# Altium project helix_4.PrjPcb
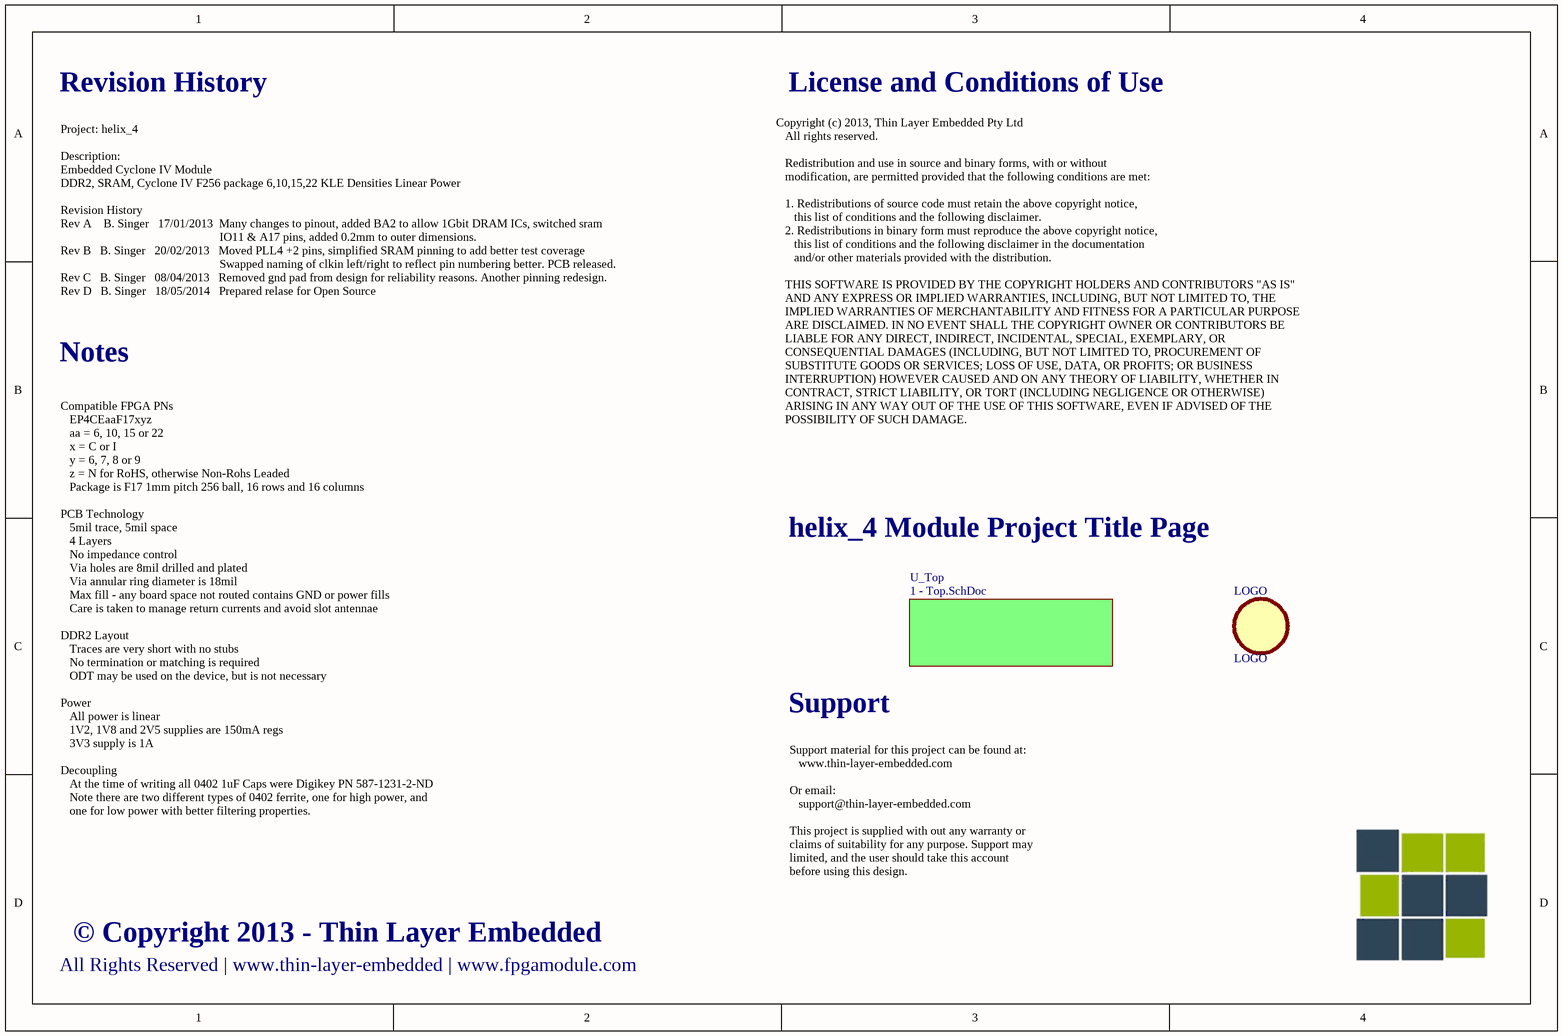
[diagram p0: 0 - Title.SchDoc]
6 sheets, 83 parts. Net scope: flat (ports and power ports of the same name join across sheets).
Board file: helix_4.PcbDoc
Sheets:
  0 - Title.SchDoc
    U_Top = 1 - Top.SchDoc
      U_FPGA = 2 - FPGA.SchDoc
      U_DDR2 DRAM = 4 - DDR2 DRAM.SchDoc
      U_SRAM = 3 - SRAM.SchDoc
      U_Power = 5 - Power.SchDoc

## Sheet 0 - Title.SchDoc
size A4; PageSetup: Record=PageOptions|CenterHorizontal=True|CenterVertical=True|PrintScale=0.71|XCorrection=1.00|YCorrection=1.00|PrintKind=1|BorderSize=5000000|LeftOffset=0|BottomOffset=0|Orientation=2|PaperLength=1000|PaperWidth=1000|Scale=100|PaperSource=258|PrintQuality=600|MediaType=1|DitherType=10|PaperKind=A4|PrintScaleMode=1

### Parts
LOGO  LOGO  [LOGO_VLARGE_SILK]

### Sub-sheets
U_Top = 1 - Top.SchDoc: no entries

### Nets

Not connected (* = marked no-connect by the designer): LOGO 1(FID)

### Notes on the sheet
- Revision History
- License and Conditions of Use
- Project: helix_4
  Description:
  Embedded Cyclone IV Module
  DDR2, SRAM, Cyclone IV F256 package 6,10,15,22 KLE Densities Linear Power
  Revision History
  Rev A    B. Singer   17/01/2013  Many changes to pinout, added BA2 to allow 1Gbit DRAM ICs, switched sram
  IO11 & A17 pins, added 0.2mm to outer dimensions.
  Rev B   B. Singer   20/02/2013   Moved PLL4 +2 pins, simplified SRAM pinning to add better test coverage
  Swapped naming of clkin left/right to reflect pin numbering better. PCB released.
  Rev C   B. Singer   08/04/2013   Removed gnd pad from design for reliability reasons. Another pinning redesign.
  Rev D   B. Singer   18/05/2014   Prepared relase for Open Source
- Notes
- Copyright (c) 2013, Thin Layer Embedded Pty Ltd
  All rights reserved.
  Redistribution and use in source and binary forms, with or without
  modification, are permitted provided that the following conditions are met:
  1. Redistributions of source code must retain the above copyright notice,
  this list of conditions and the following disclaimer.
  2. Redistributions in binary form must reproduce the above copyright notice,
  this list of conditions and the following disclaimer in the documentation
  and/or other materials provided with the distribution.
  THIS SOFTWARE IS PROVIDED BY THE COPYRIGHT HOLDERS AND CONTRIBUTORS "AS IS"
  AND ANY EXPRESS OR IMPLIED WARRANTIES, INCLUDING, BUT NOT LIMITED TO, THE
  IMPLIED WARRANTIES OF MERCHANTABILITY AND FITNESS FOR A PARTICULAR PURPOSE
  ARE DISCLAIMED. IN NO EVENT SHALL THE COPYRIGHT OWNER OR CONTRIBUTORS BE
  LIABLE FOR ANY DIRECT, INDIRECT, INCIDENTAL, SPECIAL, EXEMPLARY, OR
  CONSEQUENTIAL DAMAGES (INCLUDING, BUT NOT LIMITED TO, PROCUREMENT OF
  SUBSTITUTE GOODS OR SERVICES; LOSS OF USE, DATA, OR PROFITS; OR BUSINESS
  INTERRUPTION) HOWEVER CAUSED AND ON ANY THEORY OF LIABILITY, WHETHER IN
  CONTRACT, STRICT LIABILITY, OR TORT (INCLUDING NEGLIGENCE OR OTHERWISE)
  ARISING IN ANY WAY OUT OF THE USE OF THIS SOFTWARE, EVEN IF ADVISED OF THE
  POSSIBILITY OF SUCH DAMAGE.
- helix_4 Module Project Title Page
- Support
- Compatible FPGA PNs
  EP4CEaaF17xyz
  aa = 6, 10, 15 or 22
  x = C or I
  y = 6, 7, 8 or 9
  z = N for RoHS, otherwise Non-Rohs Leaded
  Package is F17 1mm pitch 256 ball, 16 rows and 16 columns
  PCB Technology
  5mil trace, 5mil space
  4 Layers
  No impedance control
  Via holes are 8mil drilled and plated
  Via annular ring diameter is 18mil
  Max fill - any board space not routed contains GND or power fills
  Care is taken to manage return currents and avoid slot antennae
  DDR2 Layout
  Traces are very short with no stubs
  No termination or matching is required
  ODT may be used on the device, but is not necessary
  Power
  All power is linear
  1V2, 1V8 and 2V5 supplies are 150mA regs
  3V3 supply is 1A
  Decoupling
  At the time of writing all 0402 1uF Caps were Digikey PN 587-1231-2-ND
  Note there are two different types of 0402 ferrite, one for high power, and
  one for low power with better filtering properties.
- All Rights Reserved | www.thin-layer-embedded | www.fpgamodule.com
- © Copyright 2013 - Thin Layer Embedded
- Support material for this project can be found at:
  www.thin-layer-embedded.com
  Or email:
  support@thin-layer-embedded.com
  This project is supplied with out any warranty or
  claims of suitability for any purpose. Support may
  limited, and the user should take this account
  before using this design.

### Library data of the parts
LOGO = FID

## Sheet 1 - Top.SchDoc
size A4 portrait
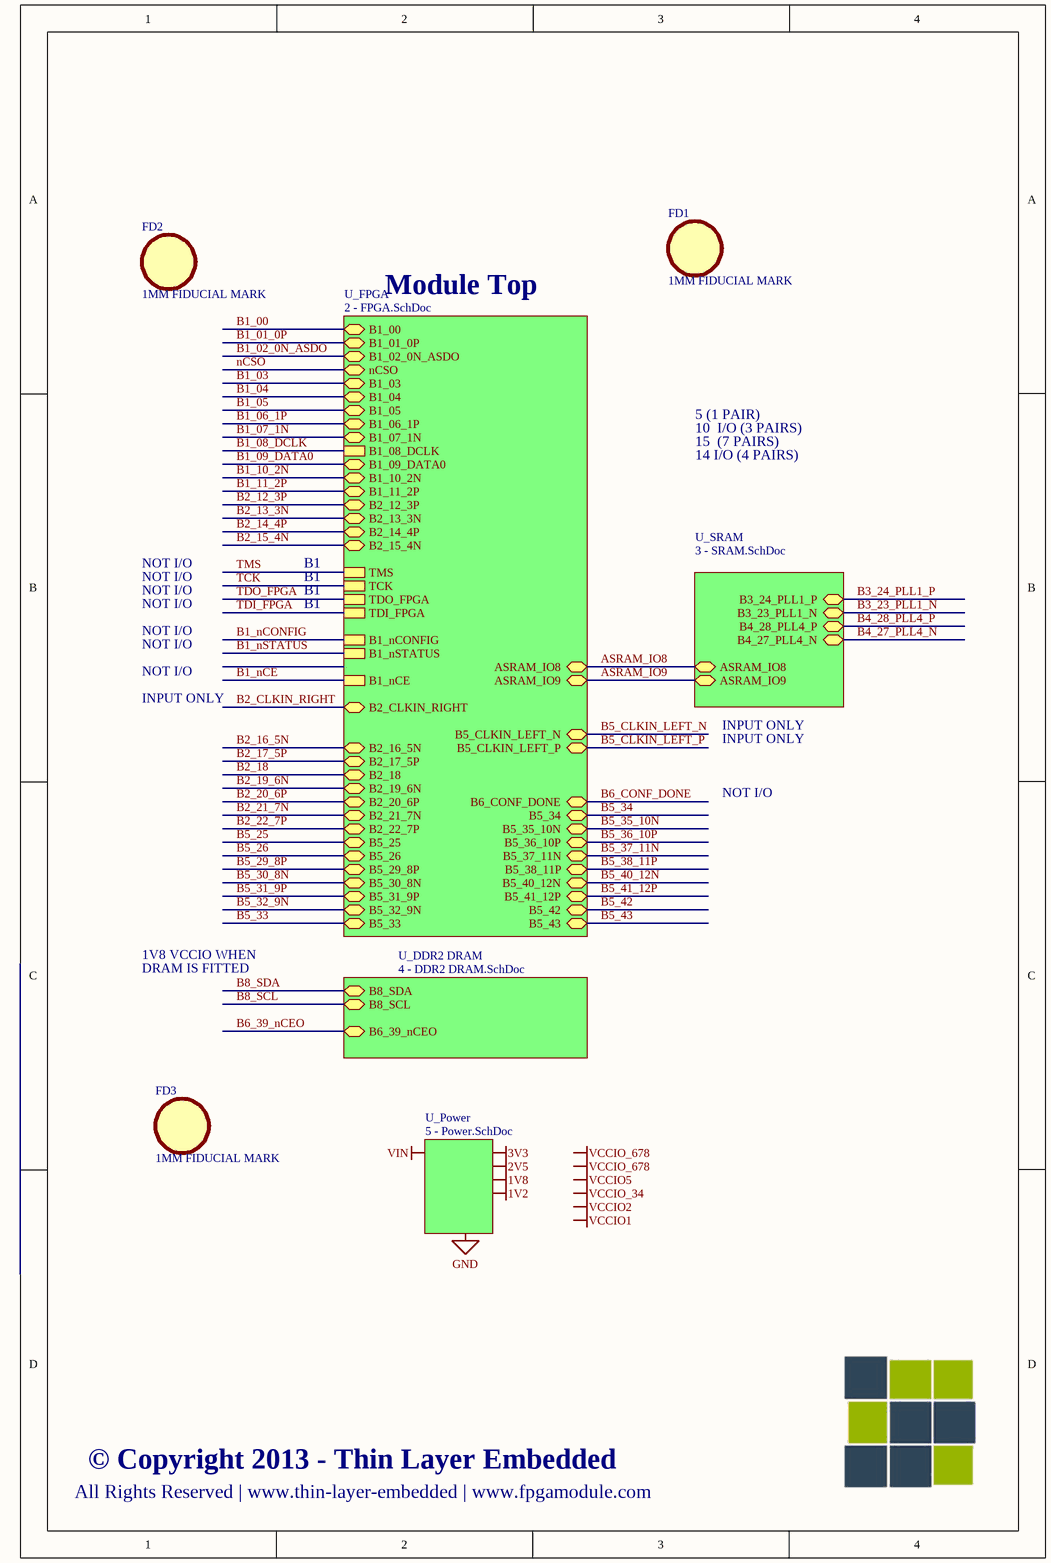
[diagram p1: 1 - Top.SchDoc]

### Parts
FD1  1MM FIDUCIAL MARK  [FID_1MM]
FD2  1MM FIDUCIAL MARK  [FID_1MM]
FD3  1MM FIDUCIAL MARK  [FID_1MM]

### Sub-sheets
U_DDR2 DRAM = 4 - DDR2 DRAM.SchDoc: B6_39_nCEO, B8_SDA, B8_SCL
U_FPGA = 2 - FPGA.SchDoc: TMS, TCK, TDO_FPGA, TDI_FPGA, B1_nCONFIG, B1_08_DCLK, B1_nCE, B2_CLKIN_RIGHT, B5_CLKIN_LEFT_N, ASRAM_IO8, B1_00, B1_04, nCSO, B1_09_DATA0, B1_01_0P, B1_02_0N_ASDO, B1_03, B1_07_1N, B1_05, B1_06_1P, B1_11_2P, B1_10_2N, B2_12_3P, B2_15_4N, B2_13_3N, B2_14_4P, B2_17_5P, B2_16_5N, B2_20_6P, B2_19_6N, B2_18, B2_21_7N, B2_22_7P, B5_32_9N, B5_29_8P, B5_35_10N, B5_41_12P, B5_31_9P, B5_30_8N, B5_34, B5_33, B5_36_10P, B5_37_11N, B5_38_11P, B5_40_12N, B5_43, B5_42, B6_CONF_DONE, B1_nSTATUS, B5_CLKIN_LEFT_P, B5_25, B5_26, ASRAM_IO9
U_Power = 5 - Power.SchDoc: no entries
U_SRAM = 3 - SRAM.SchDoc: B4_27_PLL4_N, B4_28_PLL4_P, B3_23_PLL1_N, B3_24_PLL1_P, ASRAM_IO8, ASRAM_IO9

### Nets
ASRAM_IO8: sheet U_FPGA/ASRAM_IO8, sheet U_SRAM/ASRAM_IO8
ASRAM_IO9: sheet U_FPGA/ASRAM_IO9, sheet U_SRAM/ASRAM_IO9
B1_00: sheet U_FPGA/B1_00
B1_01_0P: sheet U_FPGA/B1_01_0P
B1_02_0N_ASDO: sheet U_FPGA/B1_02_0N_ASDO
B1_03: sheet U_FPGA/B1_03
B1_04: sheet U_FPGA/B1_04
B1_05: sheet U_FPGA/B1_05
B1_06_1P: sheet U_FPGA/B1_06_1P
B1_07_1N: sheet U_FPGA/B1_07_1N
B1_08_DCLK: sheet U_FPGA/B1_08_DCLK
B1_09_DATA0: sheet U_FPGA/B1_09_DATA0
B1_10_2N: sheet U_FPGA/B1_10_2N
B1_11_2P: sheet U_FPGA/B1_11_2P
B1_nCE: sheet U_FPGA/B1_nCE
B1_nCONFIG: sheet U_FPGA/B1_nCONFIG
B1_nSTATUS: sheet U_FPGA/B1_nSTATUS
B2_12_3P: sheet U_FPGA/B2_12_3P
B2_13_3N: sheet U_FPGA/B2_13_3N
B2_14_4P: sheet U_FPGA/B2_14_4P
B2_15_4N: sheet U_FPGA/B2_15_4N
B2_16_5N: sheet U_FPGA/B2_16_5N
B2_17_5P: sheet U_FPGA/B2_17_5P
B2_18: sheet U_FPGA/B2_18
B2_19_6N: sheet U_FPGA/B2_19_6N
B2_20_6P: sheet U_FPGA/B2_20_6P
B2_21_7N: sheet U_FPGA/B2_21_7N
B2_22_7P: sheet U_FPGA/B2_22_7P
B2_CLKIN_RIGHT: sheet U_FPGA/B2_CLKIN_RIGHT
B3_23_PLL1_N: sheet U_SRAM/B3_23_PLL1_N
B3_24_PLL1_P: sheet U_SRAM/B3_24_PLL1_P
B4_27_PLL4_N: sheet U_SRAM/B4_27_PLL4_N
B4_28_PLL4_P: sheet U_SRAM/B4_28_PLL4_P
B5_25: sheet U_FPGA/B5_25
B5_26: sheet U_FPGA/B5_26
B5_29_8P: sheet U_FPGA/B5_29_8P
B5_30_8N: sheet U_FPGA/B5_30_8N
B5_31_9P: sheet U_FPGA/B5_31_9P
B5_32_9N: sheet U_FPGA/B5_32_9N
B5_33: sheet U_FPGA/B5_33
B5_34: sheet U_FPGA/B5_34
B5_35_10N: sheet U_FPGA/B5_35_10N
B5_36_10P: sheet U_FPGA/B5_36_10P
B5_37_11N: sheet U_FPGA/B5_37_11N
B5_38_11P: sheet U_FPGA/B5_38_11P
B5_40_12N: sheet U_FPGA/B5_40_12N
B5_41_12P: sheet U_FPGA/B5_41_12P
B5_42: sheet U_FPGA/B5_42
B5_43: sheet U_FPGA/B5_43
B5_CLKIN_LEFT_N: sheet U_FPGA/B5_CLKIN_LEFT_N
B5_CLKIN_LEFT_P: sheet U_FPGA/B5_CLKIN_LEFT_P
B6_39_nCEO: sheet U_DDR2 DRAM/B6_39_nCEO
B6_CONF_DONE: sheet U_FPGA/B6_CONF_DONE
B8_SCL: sheet U_DDR2 DRAM/B8_SCL
B8_SDA: sheet U_DDR2 DRAM/B8_SDA
nCSO: sheet U_FPGA/nCSO
TCK: sheet U_FPGA/TCK
TDI_FPGA: sheet U_FPGA/TDI_FPGA
TDO_FPGA: sheet U_FPGA/TDO_FPGA
TMS: sheet U_FPGA/TMS

Not connected (* = marked no-connect by the designer): FD1 1(FID); FD2 1(FID); FD3 1(FID)

### Notes on the sheet
- Module Top
- 10  I/O (3 PAIRS)
- 5 (1 PAIR)
- 15  (7 PAIRS)
- 14 I/O (4 PAIRS)
- NOT I/O
- B1
- INPUT ONLY
- 1V8 VCCIO WHEN
- DRAM IS FITTED
- All Rights Reserved | www.thin-layer-embedded | www.fpgamodule.com
- © Copyright 2013 - Thin Layer Embedded
- Labels drawn without touching a wire or pin: 1V2, 1V8, 2V5, 3V3, GND, VCCIO1, VCCIO2, VCCIO5, VCCIO_34, VCCIO_678, VIN

### Library data of the parts
FD1-FD3 = FID

## Sheet 2 - FPGA.SchDoc
size A3; PageSetup: Record=PageOptions|CenterHorizontal=True|CenterVertical=True|PrintScale=0.98|XCorrection=1.00|YCorrection=1.00|PrintKind=1|BorderSize=5000000|LeftOffset=0|BottomOffset=0|Orientation=2|PaperLength=1000|PaperWidth=1000|Scale=100|PaperSource=7|PrintQuality=-4|MediaType=1|DitherType=10|PaperKind=A4 (210 x 297 mm)|PrintScaleMode=1
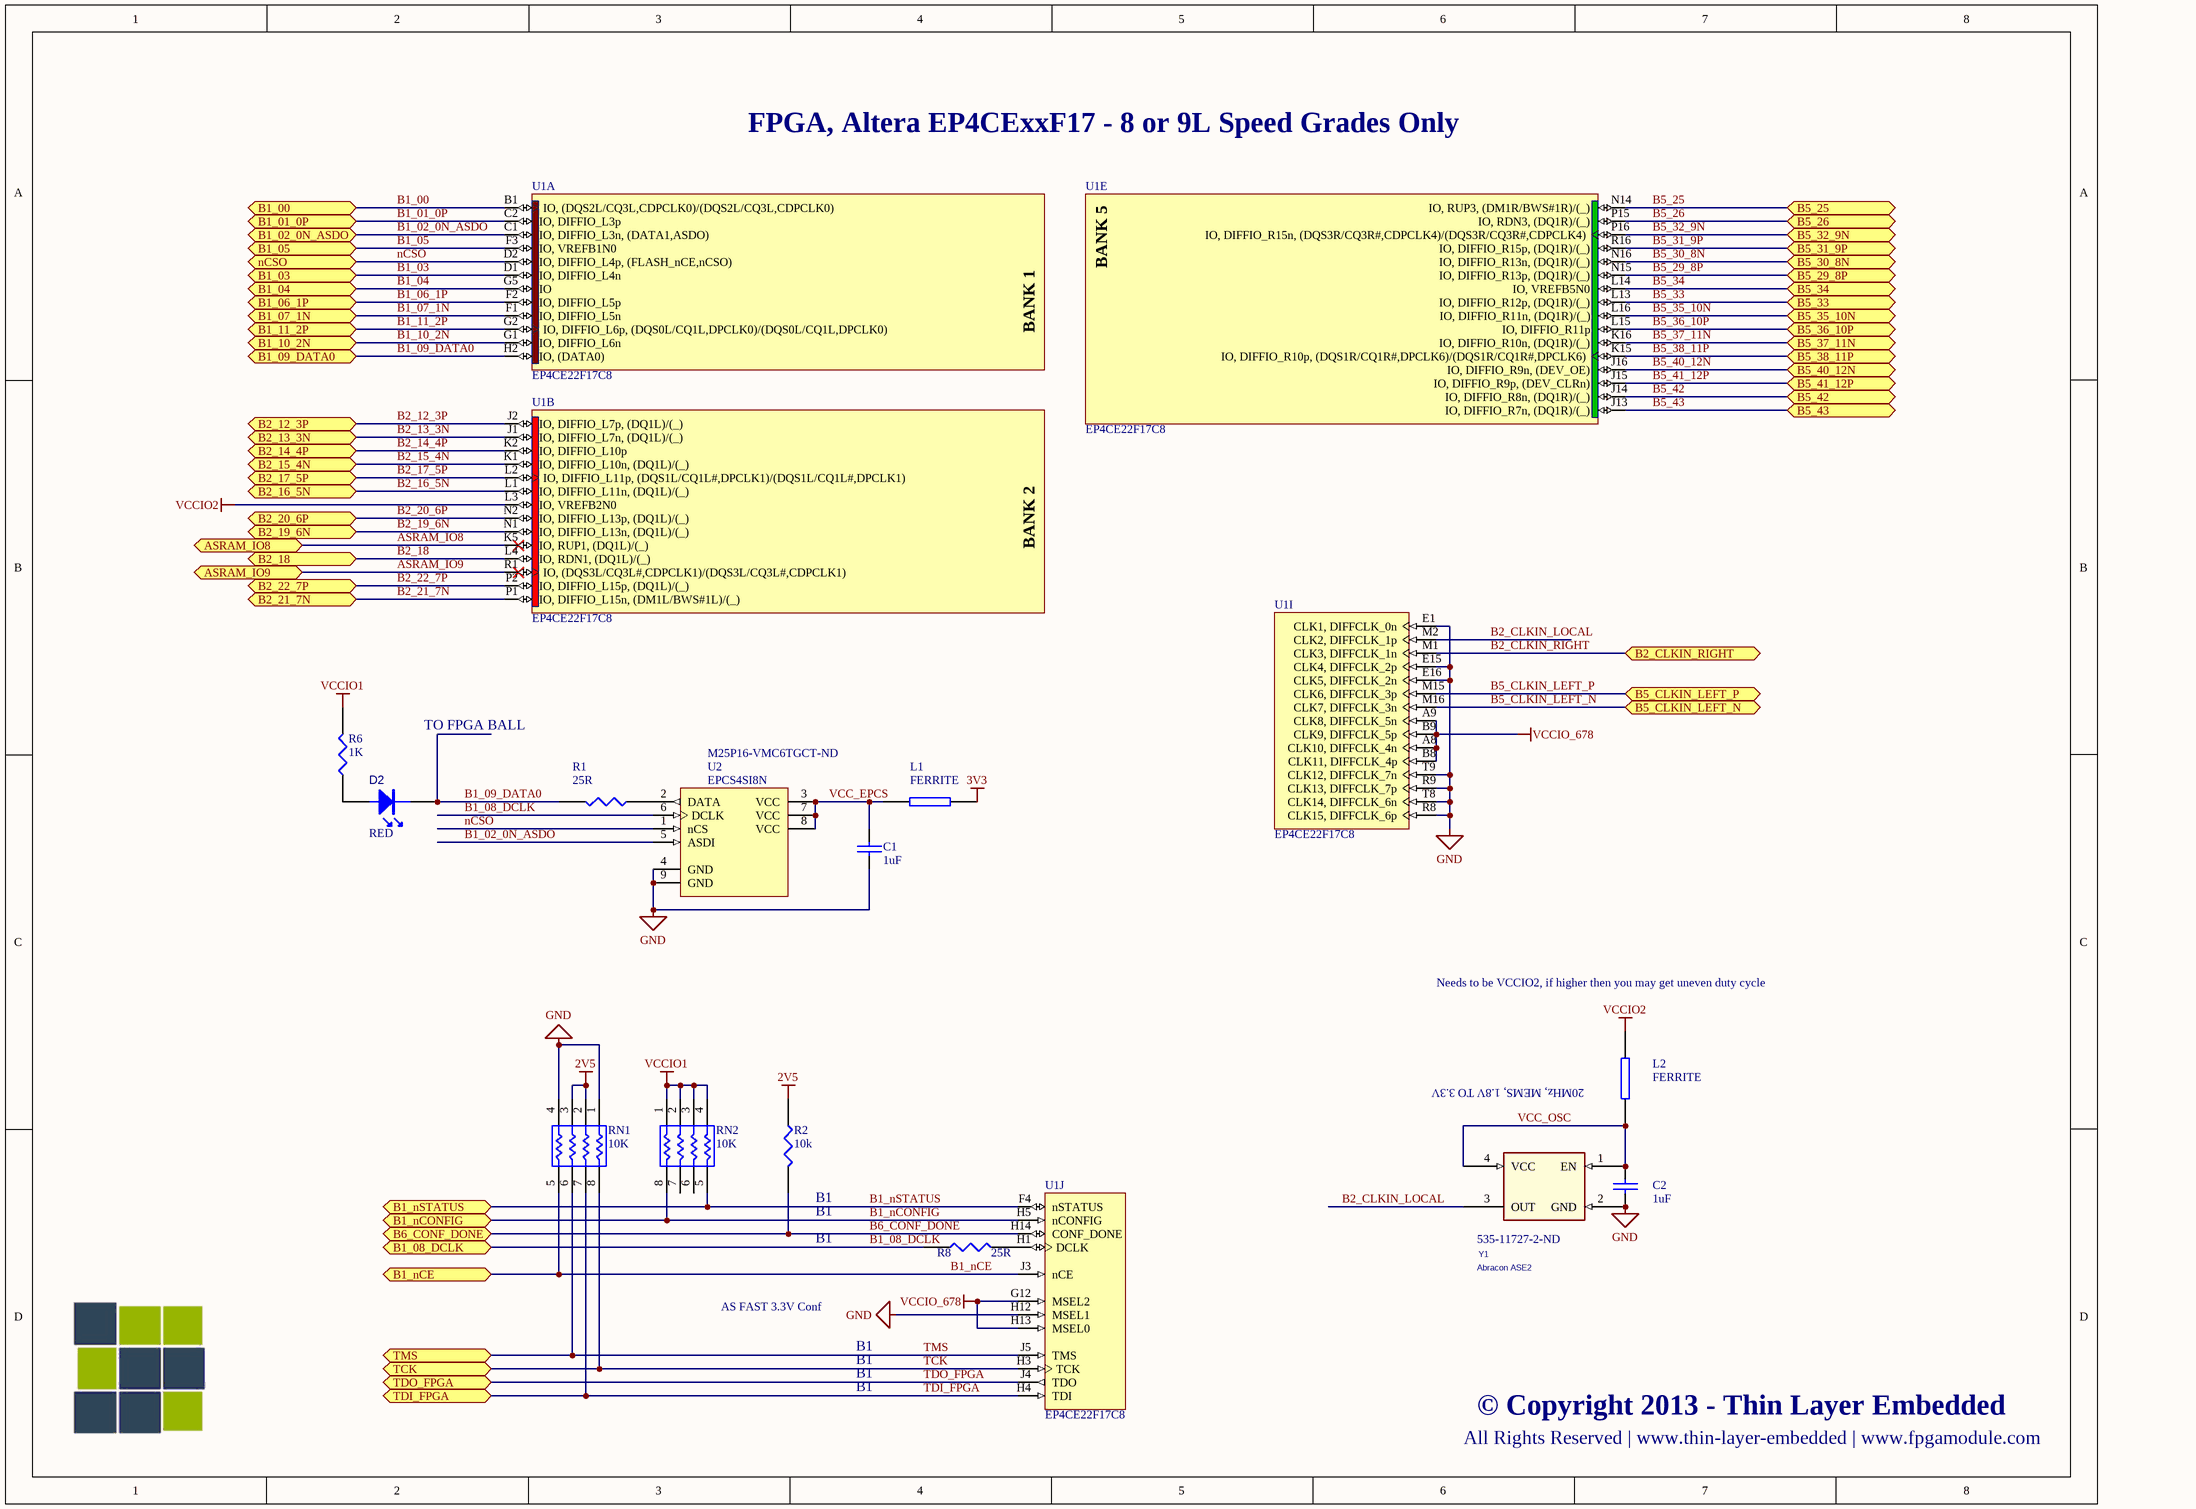
[diagram p2: 2 - FPGA.SchDoc]

### Parts
C1  1uF  [0402_hd]
C2  1uF  [0402_hd]
D2  RED  [0402LED_HD]
L1  FERRITE  [0402_HD]
L2  FERRITE  [0402_HD]
R1  25R  [0402_HD]
R2  10k  [0402_HD]
R6  1K  [0402_HD]
R8  25R  [0402_HD]
RN1  10K  [0402x4_hd]
RN2  10K  [0402x4_hd]
U1  EP4CE22F17C8  [FBGA256]  (parts A,B,E,I,J of 13)
U2  EPCS4SI8N  Supplier Part Number 1: M25P16-VMC6TGCT-ND  [UFDFPN8_4X3]
Y1  Abracon ASE2  Supplier Part Number 1: 535-11727-2-ND  [XTAL_ASDMB]

### Ports
ASRAM_IO8, ASRAM_IO9, B1_00, B1_01_0P, B1_02_0N_ASDO, B1_03, B1_04, B1_05, B1_06_1P, B1_07_1N, B1_08_DCLK, B1_09_DATA0, B1_10_2N, B1_11_2P, B1_nCE, B1_nCONFIG, B1_nSTATUS, B2_12_3P, B2_13_3N, B2_14_4P, B2_15_4N, B2_16_5N, B2_17_5P, B2_18, B2_19_6N, B2_20_6P, B2_21_7N, B2_22_7P, B2_CLKIN_RIGHT, B5_25, B5_26, B5_29_8P, B5_30_8N, B5_31_9P, B5_32_9N, B5_33, B5_34, B5_35_10N, B5_36_10P, B5_37_11N, B5_38_11P, B5_40_12N, B5_41_12P, B5_42, B5_43, B5_CLKIN_LEFT_N, B5_CLKIN_LEFT_P, B6_CONF_DONE, nCSO, TCK, TDI_FPGA, TDO_FPGA, TMS

### Nets
2V5: R2.2 RN1.2 RN1.3
3V3: L1.2
GND: C1.2 C2.2 RN1.1 RN1.4 U1.E1(CLK1,_DIFFCLK_0n) U1.E15(CLK4,_DIFFCLK_2p) U1.E16(CLK5,_DIFFCLK_2n) U1.H12(MSEL1) U1.R8(CLK15,_DIFFCLK_6p) U1.R9(CLK13,_DIFFCLK_7p) U1.T8(CLK14,_DIFFCLK_6n) U1.T9(CLK12,_DIFFCLK_7n) U2.4(GND) U2.9(GND) Y1.2(GND)
VCCIO1: R6.1 RN2.1 RN2.2 RN2.3 RN2.4
VCCIO2: L2.2 U1.L3(IO,_VREFB2N0)
VCCIO_678: U1.A8(CLK10,_DIFFCLK_4n) U1.A9(CLK8,_DIFFCLK_5n) U1.B8(CLK11,_DIFFCLK_4p) U1.B9(CLK9,_DIFFCLK_5p) U1.G12(MSEL2) U1.H13(MSEL0)
ASRAM_IO8: U1.K5(IO,_RUP1,_(DQ1L)/(_)) ; port ASRAM_IO8
ASRAM_IO9: U1.R1(IO,_(DQS3L/CQ3L#,CDPCLK1)/(DQS3L/CQ3L#,CDPCLK1)) ; port ASRAM_IO9
B1_00: U1.B1(IO,_(DQS2L/CQ3L,CDPCLK0)/(DQS2L/CQ3L,CDPCLK0)) ; port B1_00
B1_01_0P: U1.C2(IO,_DIFFIO_L3p) ; port B1_01_0P
B1_02_0N_ASDO: U1.C1(IO,_DIFFIO_L3n,_(DATA1,ASDO)) U2.5(ASDI) ; port B1_02_0N_ASDO
B1_03: U1.D1(IO,_DIFFIO_L4n) ; port B1_03
B1_04: U1.G5(IO) ; port B1_04
B1_05: U1.F3(IO,_VREFB1N0) ; port B1_05
B1_06_1P: U1.F2(IO,_DIFFIO_L5p) ; port B1_06_1P
B1_07_1N: U1.F1(IO,_DIFFIO_L5n) ; port B1_07_1N
B1_08_DCLK: R8.1 U2.6(DCLK) ; port B1_08_DCLK
B1_09_DATA0: D2.K R1.1 U1.H2(IO,_(DATA0)) ; port B1_09_DATA0
B1_10_2N: U1.G1(IO,_DIFFIO_L6n) ; port B1_10_2N
B1_11_2P: U1.G2(IO,_DIFFIO_L6p,_(DQS0L/CQ1L,DPCLK0)/(DQS0L/CQ1L,DPCLK0)) ; port B1_11_2P
B1_nCE: RN1.5 U1.J3(nCE) ; port B1_nCE
B1_nCONFIG: RN2.8 U1.H5(nCONFIG) ; port B1_nCONFIG
B1_nSTATUS: RN2.5 U1.F4(nSTATUS) ; port B1_nSTATUS
B2_12_3P: U1.J2(IO,_DIFFIO_L7p,_(DQ1L)/(_)) ; port B2_12_3P
B2_13_3N: U1.J1(IO,_DIFFIO_L7n,_(DQ1L)/(_)) ; port B2_13_3N
B2_14_4P: U1.K2(IO,_DIFFIO_L10p) ; port B2_14_4P
B2_15_4N: U1.K1(IO,_DIFFIO_L10n,_(DQ1L)/(_)) ; port B2_15_4N
B2_16_5N: U1.L1(IO,_DIFFIO_L11n,_(DQ1L)/(_)) ; port B2_16_5N
B2_17_5P: U1.L2(IO,_DIFFIO_L11p,_(DQS1L/CQ1L#,DPCLK1)/(DQS1L/CQ1L#,DPCLK1)) ; port B2_17_5P
B2_18: U1.L4(IO,_RDN1,_(DQ1L)/(_)) ; port B2_18
B2_19_6N: U1.N1(IO,_DIFFIO_L13n,_(DQ1L)/(_)) ; port B2_19_6N
B2_20_6P: U1.N2(IO,_DIFFIO_L13p,_(DQ1L)/(_)) ; port B2_20_6P
B2_21_7N: U1.P1(IO,_DIFFIO_L15n,_(DM1L/BWS#1L)/(_)) ; port B2_21_7N
B2_22_7P: U1.P2(IO,_DIFFIO_L15p,_(DQ1L)/(_)) ; port B2_22_7P
B2_CLKIN_LOCAL: U1.M2(CLK2,_DIFFCLK_1p) Y1.3(OUT)
B2_CLKIN_RIGHT: U1.M1(CLK3,_DIFFCLK_1n) ; port B2_CLKIN_RIGHT
B5_25: U1.N14(IO,_RUP3,_(DM1R/BWS#1R)/(_)) ; port B5_25
B5_26: U1.P15(IO,_RDN3,_(DQ1R)/(_)) ; port B5_26
B5_29_8P: U1.N15(IO,_DIFFIO_R13p,_(DQ1R)/(_)) ; port B5_29_8P
B5_30_8N: U1.N16(IO,_DIFFIO_R13n,_(DQ1R)/(_)) ; port B5_30_8N
B5_31_9P: U1.R16(IO,_DIFFIO_R15p,_(DQ1R)/(_)) ; port B5_31_9P
B5_32_9N: U1.P16(IO,_DIFFIO_R15n,_(DQS3R/CQ3R#,CDPCLK4)/(DQS3R/CQ3R#,CDPCLK4)) ; port B5_32_9N
B5_33: U1.L13(IO,_DIFFIO_R12p,_(DQ1R)/(_)) ; port B5_33
B5_34: U1.L14(IO,_VREFB5N0) ; port B5_34
B5_35_10N: U1.L16(IO,_DIFFIO_R11n,_(DQ1R)/(_)) ; port B5_35_10N
B5_36_10P: U1.L15(IO,_DIFFIO_R11p) ; port B5_36_10P
B5_37_11N: U1.K16(IO,_DIFFIO_R10n,_(DQ1R)/(_)) ; port B5_37_11N
B5_38_11P: U1.K15(IO,_DIFFIO_R10p,_(DQS1R/CQ1R#,DPCLK6)/(DQS1R/CQ1R#,DPCLK6)) ; port B5_38_11P
B5_40_12N: U1.J16(IO,_DIFFIO_R9n,_(DEV_OE)) ; port B5_40_12N
B5_41_12P: U1.J15(IO,_DIFFIO_R9p,_(DEV_CLRn)) ; port B5_41_12P
B5_42: U1.J14(IO,_DIFFIO_R8n,_(DQ1R)/(_)) ; port B5_42
B5_43: U1.J13(IO,_DIFFIO_R7n,_(DQ1R)/(_)) ; port B5_43
B5_CLKIN_LEFT_N: U1.M16(CLK7,_DIFFCLK_3n) ; port B5_CLKIN_LEFT_N
B5_CLKIN_LEFT_P: U1.M15(CLK6,_DIFFCLK_3p) ; port B5_CLKIN_LEFT_P
B6_CONF_DONE: R2.1 U1.H14(CONF_DONE) ; port B6_CONF_DONE
nCSO: U1.D2(IO,_DIFFIO_L4p,_(FLASH_nCE,nCSO)) U2.1(nCS) ; port nCSO
TCK: RN1.8 U1.H3(TCK) ; port TCK
TDI_FPGA: RN1.7 U1.H4(TDI) ; port TDI_FPGA
TDO_FPGA: U1.J4(TDO) ; port TDO_FPGA
TMS: RN1.6 U1.J5(TMS) ; port TMS
VCC_EPCS: C1.1 L1.1 U2.3(VCC) U2.7(VCC) U2.8(VCC)
VCC_OSC: C2.1 L2.1 Y1.1(EN) Y1.4(VCC)
NetD2_A: D2.A R6.2
NetR1_2: R1.2 U2.2(DATA)
NetR8_2: R8.2 U1.H1(DCLK)

Not connected (* = marked no-connect by the designer): RN2 6 7(17)

### Notes on the sheet
- FPGA, Altera EP4CExxF17 - 8 or 9L Speed Grades Only
- TO FPGA BALL
- Needs to be VCCIO2, if higher then you may get uneven duty cycle
- (near L2) 20MHz, MEMS, 1.8V TO 3.3V
- B1
- (near R2) B1
- AS FAST 3.3V Conf
- All Rights Reserved | www.thin-layer-embedded | www.fpgamodule.com
- © Copyright 2013 - Thin Layer Embedded
- (in symbol EP4CE22F17C8, part A) BANK 1
- (in symbol EP4CE22F17C8, part B) BANK 2
- (in symbol EP4CE22F17C8, part E) BANK 5

### Library data of the parts
C1 C2 = CAP: Capacitor
  C2: Supplier 1: Digi-Key; Supplier Part Number 1: 587-1231-2-ND
D2 = LED
R1 R2 R8 = RES1: Manufacturer: Yageo; Manufacturer Part Number: RC0402FR-0724R9L; Description: RES 24.9 OHM 1/16W 1% 0402 SMD; Resistance (Ohms): 24.9; Power (Watts): 0.063W, 1/16W; Temperature Coefficient: ±100ppm/°C; Tolerance: ±1%; Supplier 1: Digi-Key; RoHS: RoHS Compliant; Category: Resistors; Stock 1: 237555; Pricing 1: 10=0.014, 50=0.0104, 100=0.0079, 250=0.00584, 500=0.00432, 1000=0.00288 (USD); Composition: Thick Film; Features: -; Size / Dimension: 0.039" L x 0.020" W (1.00mm x 0.50mm); Height: 0.014" (0.35mm); Number of Terminations: 2; Packaging: Cut Tape (CT); Package / Case: 0402 (1005 Metric); ComponentLink1URL: http://www.yageo.com/documents/recent/PYu-RC0402_51_RoHS_L_6.pdf; ComponentLink1Description: http://www.yageo.com/documents/recent/PYu-RC0402_51_RoHS_L_6.pdf
  R1: Supplier 2: Digi-Key; Supplier Part Number 2: 311-24.9HRCT-ND; Stock 2: 302870; Pricing 2: 10=0.014, 50=0.0104, 100=0.0079, 250=0.00584, 500=0.00432, 1000=0.00288 (USD); ComponentLink2URL: http://www.yageo.com/documents/recent/PYu-RC0603_51_RoHS_L_4.pdf; ComponentLink2Description: http://www.yageo.com/documents/recent/PYu-RC0603_51_RoHS_L_4.pdf
  R2: Supplier 2: Digi-Key; Stock 2: 302870; Pricing 2: 10=0.014, 50=0.0104, 100=0.0079, 250=0.00584, 500=0.00432, 1000=0.00288 (USD); ComponentLink2URL: http://www.yageo.com/documents/recent/PYu-RC0603_51_RoHS_L_4.pdf; ComponentLink2Description: http://www.yageo.com/documents/recent/PYu-RC0603_51_RoHS_L_4.pdf
  R8: Supplier Part Number 1: 311-24.9LRCT-ND
R6 = RES1
RN1 RN2 = RESNET1
U1 = EP4CE22F17C8: Cyclone IV Family FPGA, 2V Core, 153 I/O Pins, 4 PLLs, 256-Pin FBGA, Speed Grade 8, Commercial Grade; Published: 3-May-2010; DatasheetVersion: ver1.2, Mar-2010; PackageVersion: ver16.0, Dec-2009; PackageReference: FBGA256; Publisher: Altium Limited; PackageDescription: 256-Ball FineLine Ball Grid Array (FBGA256) - Option 1 - Wire Bond; Code_JEDEC: MS-034-AAF-1; Code_IPC: BGA100P16X16-256; ComponentLink1Description: Manufacturer Link; ComponentLink1URL: http://www.altera.com/; ComponentLink2Description: Handbook; ComponentLink2URL: http://www.altera.com/literature/hb/cyclone-iv/cyclone4-handbook.pdf; ComponentLink3Description: Pinout Specification; ComponentLink3URL: http://www.altera.com/literature/lit-dp.jsp?category=cyc%204&showspreadsheet=y; ComponentLink4Description: Packaging Specification; ComponentLink4URL: http://www.altera.com/literature/ds/dspkg.pdf
U2 = EPCS4SI8N: EPCS4 Series, In-system programmable 3.3V serial configuration device, 8-Pin SOIC, 4-Megabit, Industrial Grade, Pb-Free; Manufacturer: Numonyx - A DIVISION OF MICRON SEMICONDUCTOR PRODUCTS, INC.; Manufacturer Part Number: M25P16-VMC6TG; Configures: Cyclone II, Stratix II, & Cyclone Devices; Description: IC SRL FLASH 16MBIT 75MHZ MLP8; Format - Memory: FLASH; Memory Size: 16M (2M x 8); Speed: 75MHz; Interface: SPI, 3-Wire Serial; Voltage - Supply: 2.7 V ~ 3.6 V; Published: 4-Mar-2005; LatestRevisionDate: 13-Apr-2006; LatestRevisionNote: IPC-7351 Footprint Added.; DatasheetVersion: ver2.0, Oct-2003; PackageVersion: ver13.0, May-2005; PackageReference: SOIC8; Publisher: Altium Limited; PackageDescription: 8-Pin Small Outline Integrated Circuit Package (SOIC8); Code_JEDEC: MS-012-AA; Code_IPC: SOIC127P600-8; ComponentLink1Description: Manufacturer Link; ComponentLink1URL: http://www.altera.com/products/devices/config/cfg-index.html; ComponentLink2Description: Configuration Handbook; ComponentLink2URL: http://www.altera.com/literature/hb/cfg/config_handbook.pdf; ComponentLink3Description: Pinout Specification; ComponentLink3URL: http://www.altera.com/literature/hb/cfg/cyc_c51014.pdf; ComponentLink4Description: Packaging Specification; ComponentLink4URL: http://www.altera.com/literature/ds/dspkg.pdf; Supplier 1: Digi-Key; RoHS: RoHS Compliant; Category: Integrated Circuits (ICs); Stock 1: 6116; Pricing 1: 1=2, 10=1.71, 25=1.5392, 100=1.3965, 250=1.254, 500=1.083, 1000=0.912 (USD); Memory Type: FLASH; Operating Temperature: -40°C ~ 85°C; Package / Case: 8-UDFN; Supplier Device Package: 8-UFDFPN; Packaging: Cut Tape (CT); ComponentLink5URL: http://media.digikey.com/pdf/Data%20Sheets/Numonyx,Intel/M25P16.pdf; ComponentLink5Description: http://media.digikey.com/pdf/Data%20Sheets/Numonyx,Intel/M25P16.pdf
Y1 = OSC_ALT: OSC - 50MHZ, +/-50PPM, 1.8V, CMOS CLOCK OSCILLATOR, SMD; Manufacturer Part Num: SM5545TEX-50.00M; Manufacturer: Pletronics; Part Class: Oscillators; Num Pins: 4; Item Num: P13-26191R; RoHS Compliant: Yes; Lead Free Status: No; Supplier 1: Digi-Key

## Sheet 4 - DDR2 DRAM.SchDoc
size A3
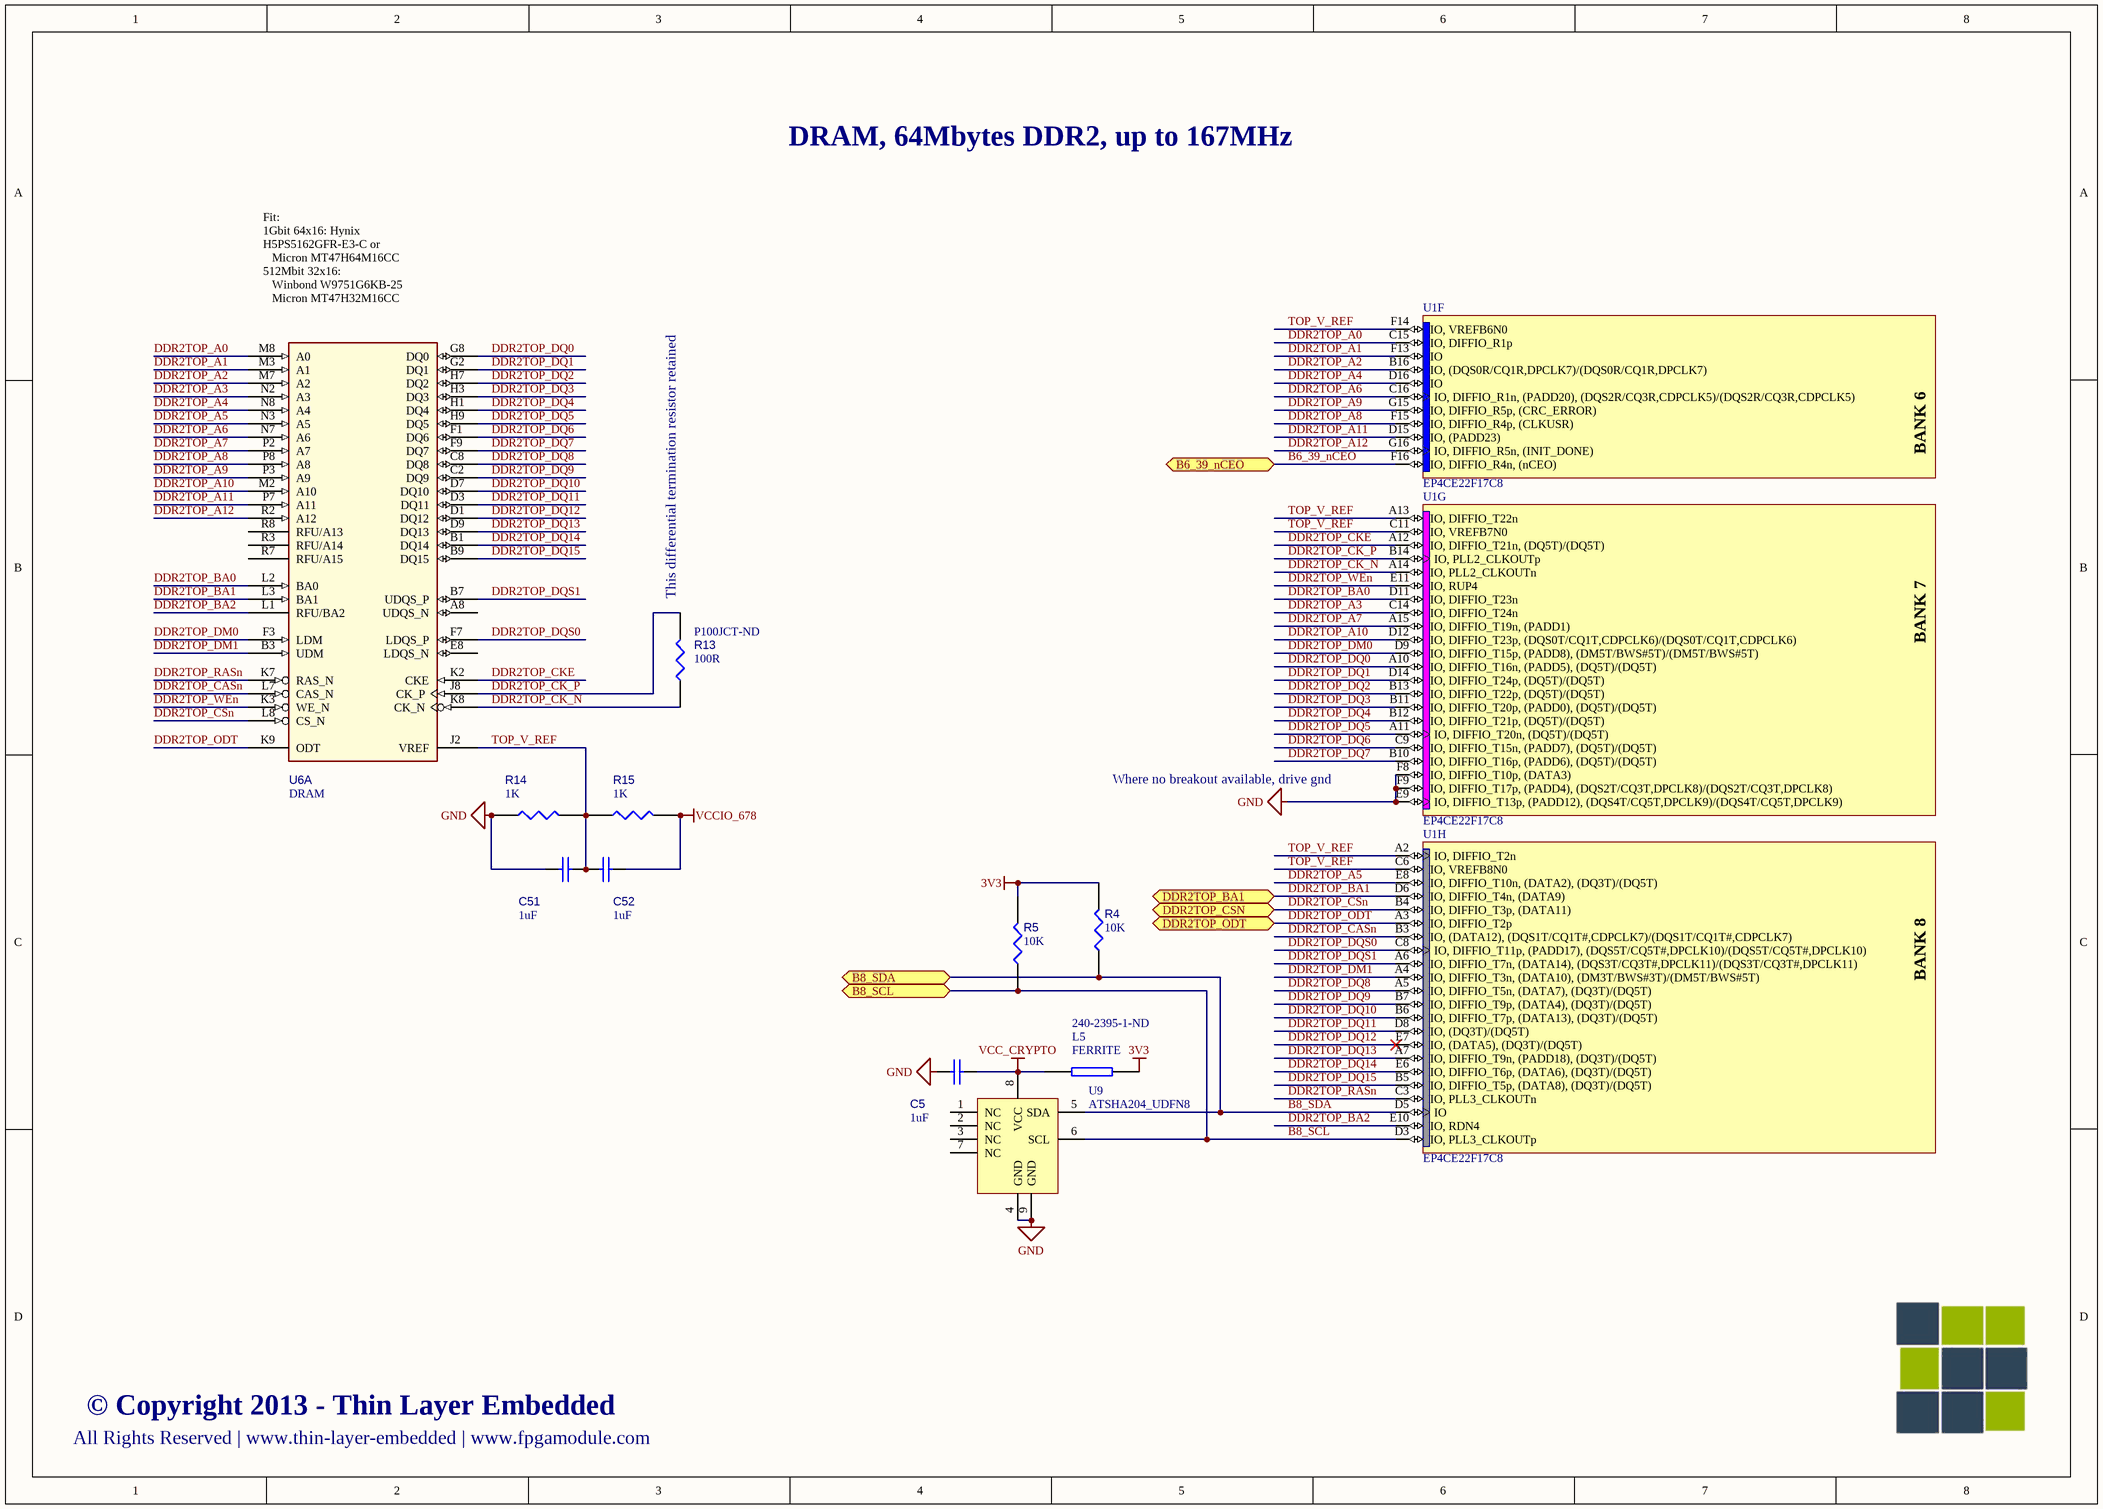
[diagram p3: 4 - DDR2 DRAM.SchDoc]

### Parts
C5  1uF  [0402_HD]
C51  1uF  [0402_HD]
C52  1uF  [0402_HD]
L5  FERRITE  Supplier Part Number 1: 240-2395-1-ND  [0402_HD]
R4  10K  [0402_HD]
R5  10K  [0402_HD]
R13  100R  Supplier Part Number 1: P100JCT-ND  [0402_HD]
R14  1K  [0402_HD]
R15  1K  [0402_HD]
U1  EP4CE22F17C8  [FBGA256]  (parts F,G,H of 13)
U6  DRAM  [DDR2_84_SPEC_HD]  (part A of 2)
U9  ATSHA204_UDFN8  [UDFN8]

### Ports
B6_39_nCEO, B8_SCL, B8_SDA, DDR2TOP_BA1, DDR2TOP_CSN, DDR2TOP_ODT

### Nets
3V3: L5.2 R4.1 R5.1
GND: C5.2 C51.2 R14.2 U1.E9(IO,_DIFFIO_T13p,_(PADD12),_(DQS4T/CQ5T,DPCLK9)/(DQS4T/CQ5T,DPCLK9)) U1.F8(IO,_DIFFIO_T10p,_(DATA3)) U1.F9(IO,_DIFFIO_T17p,_(PADD4),_(DQS2T/CQ3T,DPCLK8)/(DQS2T/CQ3T,DPCLK8)) U9.4(GND) U9.9(GND)
VCC_CRYPTO: C5.1 L5.1 U9.8(VCC)
VCCIO_678: C52.1 R15.1
B6_39_nCEO: U1.F16(IO,_DIFFIO_R4n,_(nCEO)) ; port B6_39_nCEO
B8_SCL: R5.2 U1.D3(IO,_PLL3_CLKOUTp) U9.6(SCL) ; port B8_SCL
B8_SDA: R4.2 U1.D5(IO) U9.5(SDA) ; port B8_SDA
DDR2TOP_A0: U1.C15(IO,_DIFFIO_R1p) U6.M8(A0)
DDR2TOP_A1: U1.F13(IO) U6.M3(A1)
DDR2TOP_A2: U1.B16(IO,_(DQS0R/CQ1R,DPCLK7)/(DQS0R/CQ1R,DPCLK7)) U6.M7(A2)
DDR2TOP_A3: U1.C14(IO,_DIFFIO_T24n) U6.N2(A3)
DDR2TOP_A4: U1.D16(IO) U6.N8(A4)
DDR2TOP_A5: U1.E8(IO,_DIFFIO_T10n,_(DATA2),_(DQ3T)/(DQ5T)) U6.N3(A5)
DDR2TOP_A6: U1.C16(IO,_DIFFIO_R1n,_(PADD20),_(DQS2R/CQ3R,CDPCLK5)/(DQS2R/CQ3R,CDPCLK5)) U6.N7(A6)
DDR2TOP_A7: U1.A15(IO,_DIFFIO_T19n,_(PADD1)) U6.P2(A7)
DDR2TOP_A8: U1.F15(IO,_DIFFIO_R4p,_(CLKUSR)) U6.P8(A8)
DDR2TOP_A9: U1.G15(IO,_DIFFIO_R5p,_(CRC_ERROR)) U6.P3(A9)
DDR2TOP_A10: U1.D12(IO,_DIFFIO_T23p,_(DQS0T/CQ1T,CDPCLK6)/(DQS0T/CQ1T,CDPCLK6)) U6.M2(A10)
DDR2TOP_A11: U1.D15(IO,_(PADD23)) U6.P7(A11)
DDR2TOP_A12: U1.G16(IO,_DIFFIO_R5n,_(INIT_DONE)) U6.R2(A12)
DDR2TOP_BA0: U1.D11(IO,_DIFFIO_T23n) U6.L2(BA0)
DDR2TOP_BA1: U1.D6(IO,_DIFFIO_T4n,_(DATA9)) U6.L3(BA1) ; port DDR2TOP_BA1
DDR2TOP_BA2: U1.E10(IO,_RDN4) U6.L1(RFU/BA2)
DDR2TOP_CASn: U1.B3(IO,_(DATA12),_(DQS1T/CQ1T#,CDPCLK7)/(DQS1T/CQ1T#,CDPCLK7)) U6.L7(CAS_N)
DDR2TOP_CK_N: R13.2 U1.A14(IO,_PLL2_CLKOUTn) U6.K8(CK_N)
DDR2TOP_CK_P: R13.1 U1.B14(IO,_PLL2_CLKOUTp) U6.J8(CK_P)
DDR2TOP_CKE: U1.A12(IO,_DIFFIO_T21n,_(DQ5T)/(DQ5T)) U6.K2(CKE)
DDR2TOP_CSn: U1.B4(IO,_DIFFIO_T3p,_(DATA11)) U6.L8(CS_N) ; port DDR2TOP_CSN
DDR2TOP_DM0: U1.D9(IO,_DIFFIO_T15p,_(PADD8),_(DM5T/BWS#5T)/(DM5T/BWS#5T)) U6.F3(LDM)
DDR2TOP_DM1: U1.A4(IO,_DIFFIO_T3n,_(DATA10),_(DM3T/BWS#3T)/(DM5T/BWS#5T)) U6.B3(UDM)
DDR2TOP_DQ0: U1.A10(IO,_DIFFIO_T16n,_(PADD5),_(DQ5T)/(DQ5T)) U6.G8(DQ0)
DDR2TOP_DQ1: U1.D14(IO,_DIFFIO_T24p,_(DQ5T)/(DQ5T)) U6.G2(DQ1)
DDR2TOP_DQ2: U1.B13(IO,_DIFFIO_T22p,_(DQ5T)/(DQ5T)) U6.H7(DQ2)
DDR2TOP_DQ3: U1.B11(IO,_DIFFIO_T20p,_(PADD0),_(DQ5T)/(DQ5T)) U6.H3(DQ3)
DDR2TOP_DQ4: U1.B12(IO,_DIFFIO_T21p,_(DQ5T)/(DQ5T)) U6.H1(DQ4)
DDR2TOP_DQ5: U1.A11(IO,_DIFFIO_T20n,_(DQ5T)/(DQ5T)) U6.H9(DQ5)
DDR2TOP_DQ6: U1.C9(IO,_DIFFIO_T15n,_(PADD7),_(DQ5T)/(DQ5T)) U6.F1(DQ6)
DDR2TOP_DQ7: U1.B10(IO,_DIFFIO_T16p,_(PADD6),_(DQ5T)/(DQ5T)) U6.F9(DQ7)
DDR2TOP_DQ8: U1.A5(IO,_DIFFIO_T5n,_(DATA7),_(DQ3T)/(DQ5T)) U6.C8(DQ8)
DDR2TOP_DQ9: U1.B7(IO,_DIFFIO_T9p,_(DATA4),_(DQ3T)/(DQ5T)) U6.C2(DQ9)
DDR2TOP_DQ10: U1.B6(IO,_DIFFIO_T7p,_(DATA13),_(DQ3T)/(DQ5T)) U6.D7(DQ10)
DDR2TOP_DQ11: U1.D8(IO,_(DQ3T)/(DQ5T)) U6.D3(DQ11)
DDR2TOP_DQ12: U1.E7(IO,_(DATA5),_(DQ3T)/(DQ5T)) U6.D1(DQ12)
DDR2TOP_DQ13: U1.A7(IO,_DIFFIO_T9n,_(PADD18),_(DQ3T)/(DQ5T)) U6.D9(DQ13)
DDR2TOP_DQ14: U1.E6(IO,_DIFFIO_T6p,_(DATA6),_(DQ3T)/(DQ5T)) U6.B1(DQ14)
DDR2TOP_DQ15: U1.B5(IO,_DIFFIO_T5p,_(DATA8),_(DQ3T)/(DQ5T)) U6.B9(DQ15)
DDR2TOP_DQS0: U1.C8(IO,_DIFFIO_T11p,_(PADD17),_(DQS5T/CQ5T#,DPCLK10)/(DQS5T/CQ5T#,DPCLK10)) U6.F7(LDQS_P)
DDR2TOP_DQS1: U1.A6(IO,_DIFFIO_T7n,_(DATA14),_(DQS3T/CQ3T#,DPCLK11)/(DQS3T/CQ3T#,DPCLK11)) U6.B7(UDQS_P)
DDR2TOP_ODT: U1.A3(IO,_DIFFIO_T2p) U6.K9(ODT) ; port DDR2TOP_ODT
DDR2TOP_RASn: U1.C3(IO,_PLL3_CLKOUTn) U6.K7(RAS_N)
DDR2TOP_WEn: U1.E11(IO,_RUP4) U6.K3(WE_N)
TOP_V_REF: C51.1 C52.2 R14.1 R15.2 U1.A2(IO,_DIFFIO_T2n) U1.A13(IO,_DIFFIO_T22n) U1.C6(IO,_VREFB8N0) U1.C11(IO,_VREFB7N0) U1.F14(IO,_VREFB6N0) U6.J2(VREF)

Not connected (* = marked no-connect by the designer): U6 A8(UDQS_N) E8(LDQS_N) R3(RFU/A14) R7(RFU/A15) R8(RFU/A13); U9 1(NC) 2(NC) 3(NC) 7(NC)

### Notes on the sheet
- DRAM, 64Mbytes DDR2, up to 167MHz
- Fit:
  1Gbit 64x16: Hynix H5PS5162GFR-E3-C or
  Micron MT47H64M16CC
  512Mbit 32x16:
  Winbond W9751G6KB-25
  Micron MT47H32M16CC
- (near R13) This differential termination resistor retained
- Where no breakout available, drive gnd
- All Rights Reserved | www.thin-layer-embedded | www.fpgamodule.com
- © Copyright 2013 - Thin Layer Embedded
- (in symbol EP4CE22F17C8, part F) BANK 6
- (in symbol EP4CE22F17C8, part G) BANK 7
- (in symbol EP4CE22F17C8, part H) BANK 8

### Library data of the parts
C5 C51 C52 = CAP: Capacitor; Supplier 1: Digi-Key; Supplier Part Number 1: 587-1231-2-ND
L5 = FERRITE: Manufacturer: Laird-Signal Integrity Products; Manufacturer Part Number: HI0805R800R-10; Description: FERRITE CHIP POWER 80 OHM SMD; Impedance @ Frequency: 80 Ohm @ 100MHz; Current Rating: 5A; DC Resistance (DCR): 10.00 mOhm Max; Filter Type: Differential Mode - Single; Number of Lines: 1; Supplier 1: Digi-Key; RoHS: RoHS Compliant; Category: Filters; Stock 1: 36575; Pricing 1: 10=0.089, 50=0.0768, 100=0.0708, 250=0.059, 500=0.0531, 1000=0.0472 (USD); Package / Case: 0805 (2012 metric); Mounting Type: Surface Mount; Packaging: Cut Tape (CT); ComponentLink1URL: http://www.steward.com/view_print.asp?St_PartNo=HI0805R800R-10; ComponentLink1Description: http://www.steward.com/view_print.asp?St_PartNo=HI0805R800R-10
R4 R5 = RES1
R13 = RES1: Manufacturer: Panasonic - ECG; Manufacturer Part Number: ERJ-2GEJ101X; Description: RES 100 OHM 1/10W 5% 0402 SMD; Resistance (Ohms): 100; Power (Watts): 0.1W, 1/10W; Temperature Coefficient: ±200ppm/°C; Tolerance: ±5%; Supplier 1: Digi-Key; RoHS: RoHS Compliant; Category: Resistors; Stock 1: 2686964; Pricing 1: 1=0.05, 50=0.0172, 100=0.0131, 250=0.00976, 500=0.0072, 1000=0.0048, 5000=0.00338 (USD); Composition: Thick Film; Features: -; Size / Dimension: 0.039" L x 0.020" W (1.00mm x 0.50mm); Height: 0.016" (0.40mm); Number of Terminations: 2; Packaging: Cut Tape (CT); Package / Case: 0402 (1005 Metric); ComponentLink1URL: http://industrial.panasonic.com/www-cgi/jvcr13pz.cgi?E+PZ+3+AOA0001+ERJ2GEJ101X+7+WW; ComponentLink1Description: http://industrial.panasonic.com/www-cgi/jvcr13pz.cgi?E+PZ+3+AOA0001+ERJ2GEJ101X+7+WW
R14 R15 = RES1: Manufacturer: Yageo; Manufacturer Part Number: RC0603JR-071KL; Description: RES 1.0K OHM 1/10W 5% 0603 SMD; Power (Watts): 0.1W, 1/10W; Temperature Coefficient: ±100ppm/°C; Tolerance: ±5%; Supplier 1: Digi-Key; RoHS: RoHS Compliant; Category: Resistors; Stock 1: 5591800; Pricing 1: 10=0.01, 50=0.008, 100=0.006, 250=0.00448, 500=0.00332, 1000=0.00221 (USD); Resistance (Ohms): 1K; Composition: Thick Film; Features: -; Size / Dimension: 0.063" L x 0.031" W (1.60mm x 0.80mm); Height: 0.018" (0.45mm); Number of Terminations: 2; Packaging: Cut Tape (CT); Package / Case: 0603 (1608 Metric); ComponentLink1URL: http://www.yageo.com/documents/recent/PYu-RC0603_51_RoHS_L_4.pdf; ComponentLink1Description: http://www.yageo.com/documents/recent/PYu-RC0603_51_RoHS_L_4.pdf; Supplier 2: Digi-Key; Supplier Part Number 2: P1.0KJCT-ND; Stock 2: 5981822; Pricing 2: 1=0.05, 50=0.0172, 100=0.0131, 250=0.00976, 500=0.0072, 1000=0.0048, 5000=0.00338 (USD); ComponentLink2URL: http://industrial.panasonic.com/www-cgi/jvcr13pz.cgi?E+PZ+3+AOA0001+ERJ2GEJ102X+7+WW; ComponentLink2Description: http://industrial.panasonic.com/www-cgi/jvcr13pz.cgi?E+PZ+3+AOA0001+ERJ2GEJ102X+7+WW
U1 = EP4CE22F17C8: as U1 on sheet 2 - FPGA; Published: 3-May-2010; DatasheetVersion: ver1.2, Mar-2010; PackageVersion: ver16.0, Dec-2009; PackageReference: FBGA256; Publisher: Altium Limited; PackageDescription: 256-Ball FineLine Ball Grid Array (FBGA256) - Option 1 - Wire Bond; Code_JEDEC: MS-034-AAF-1; Code_IPC: BGA100P16X16-256; ComponentLink1Description: Manufacturer Link; ComponentLink1URL: http://www.altera.com/; ComponentLink2Description: Handbook; ComponentLink2URL: http://www.altera.com/literature/hb/cyclone-iv/cyclone4-handbook.pdf; ComponentLink3Description: Pinout Specification; ComponentLink3URL: http://www.altera.com/literature/lit-dp.jsp?category=cyc%204&showspreadsheet=y; ComponentLink4Description: Packaging Specification; ComponentLink4URL: http://www.altera.com/literature/ds/dspkg.pdf
U6 = MT47H32M16CC: IC DDR2 SDRAM 32M X 16 4 BANKS 333MHZ CAS LATENCY 5 FBGA PACKAGE 84 PINS 1.8V CORE 1.8V IO

## Sheet 3 - SRAM.SchDoc
size 386 x 246 mm
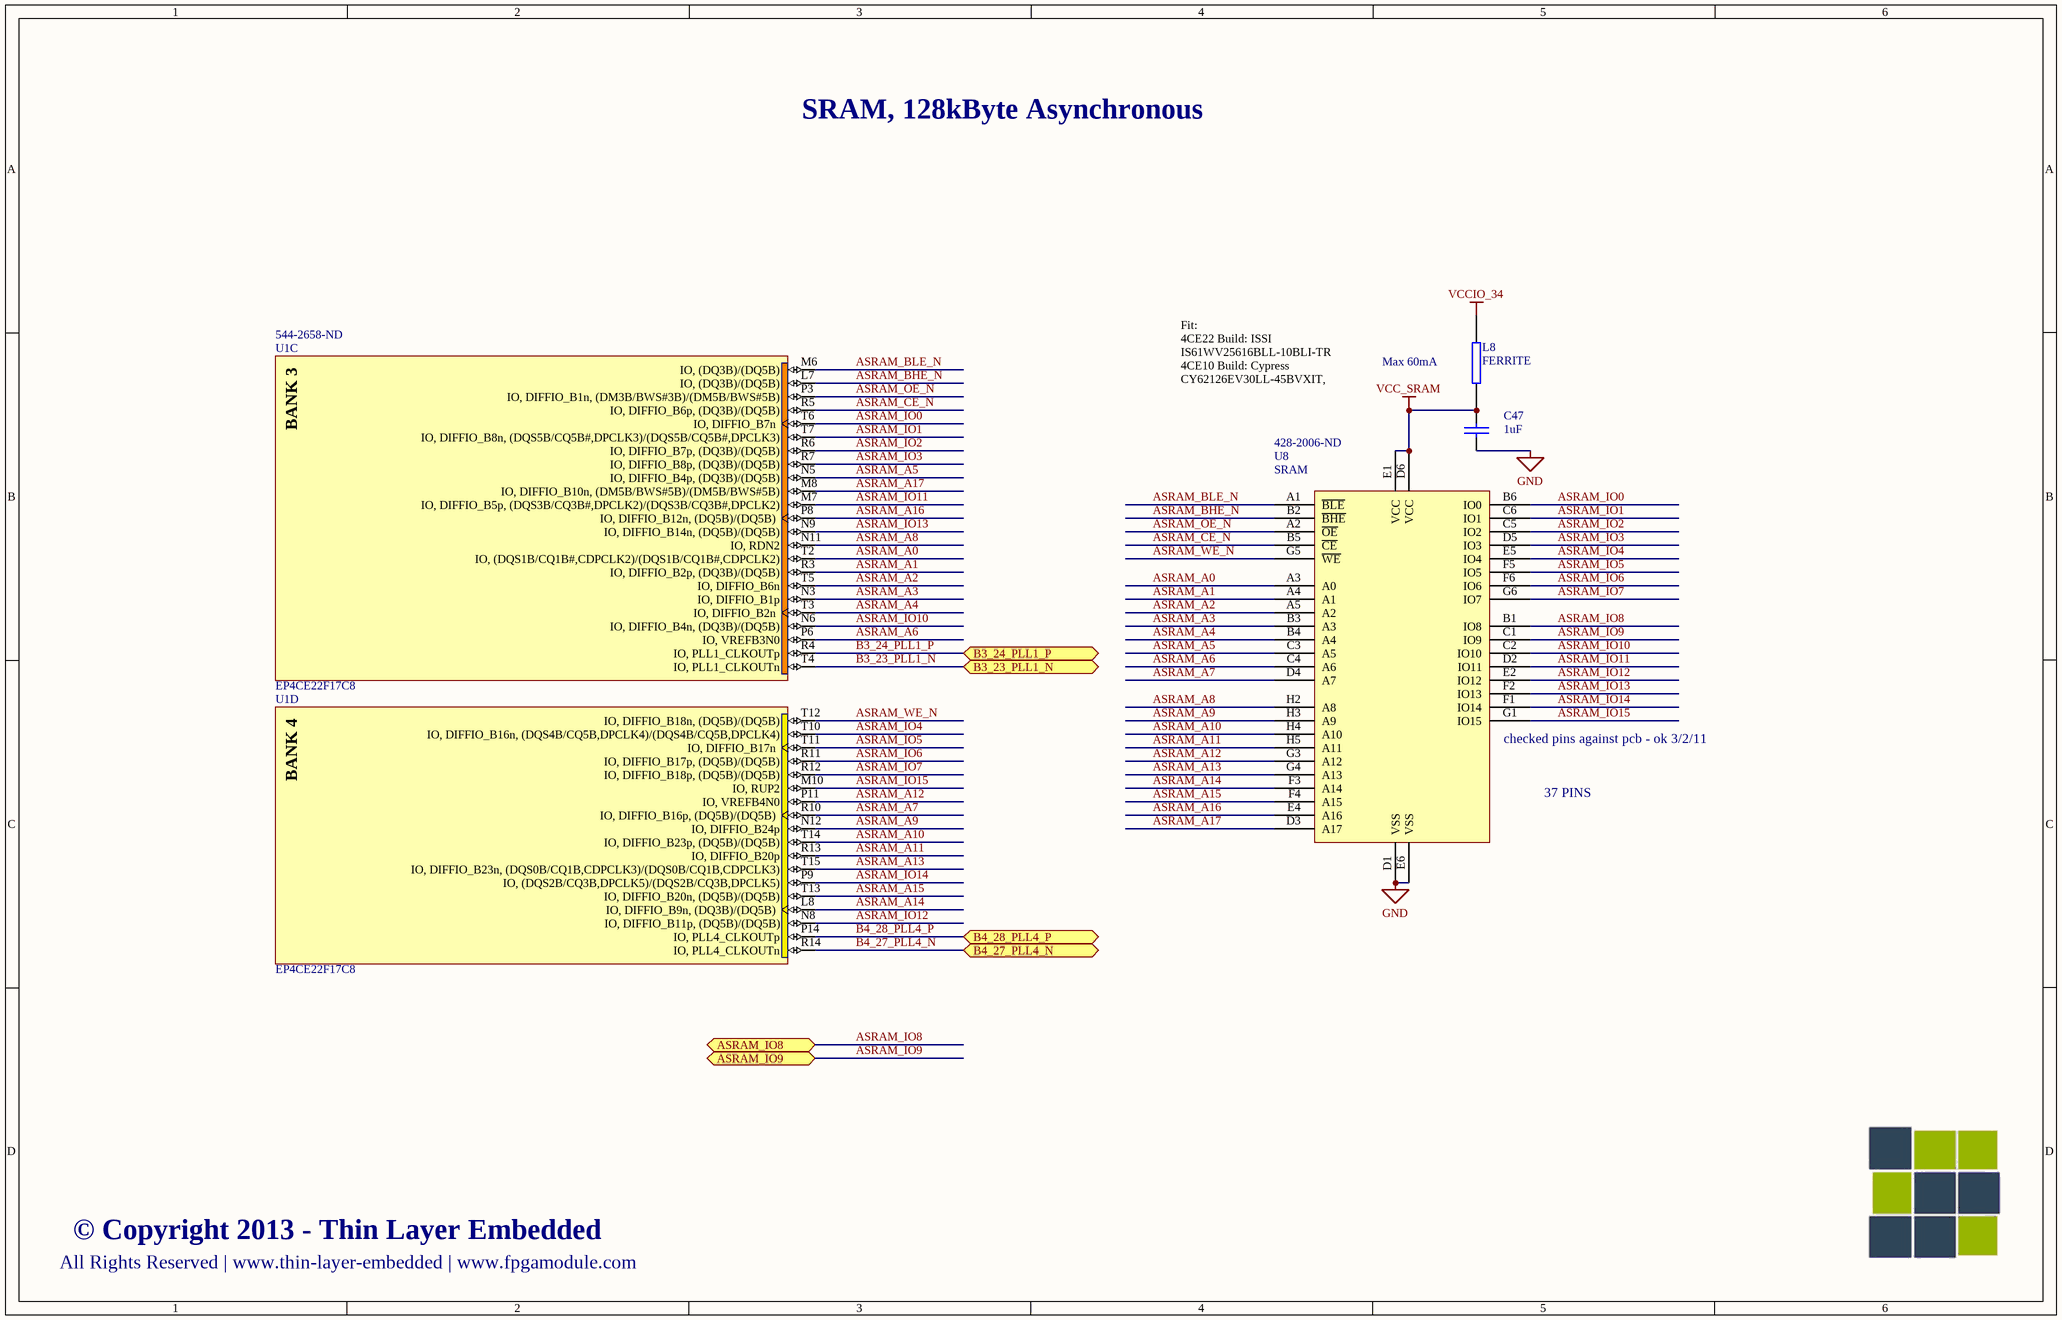
[diagram p4: 3 - SRAM.SchDoc]

### Parts
C47  1uF  [0402_HD]
L8  FERRITE  [0402_HD]
U1  EP4CE22F17C8  Supplier Part Number 1: 544-2658-ND  [FBGA256]  (parts C,D of 13)
U8  SRAM  Supplier Part Number 1: 428-2006-ND  [VFBGA48]

### Ports
ASRAM_IO8, ASRAM_IO9, B3_23_PLL1_N, B3_24_PLL1_P, B4_27_PLL4_N, B4_28_PLL4_P

### Nets
GND: C47.2 U8.D1(VSS) U8.E6(VSS)
VCC_SRAM: C47.1 L8.1 U8.D6(VCC) U8.E1(VCC)
VCCIO_34: L8.2
ASRAM_A0: U1.T2(IO,_(DQS1B/CQ1B#,CDPCLK2)/(DQS1B/CQ1B#,CDPCLK2)) U8.A3(A0)
ASRAM_A1: U1.R3(IO,_DIFFIO_B2p,_(DQ3B)/(DQ5B)) U8.A4(A1)
ASRAM_A2: U1.T5(IO,_DIFFIO_B6n) U8.A5(A2)
ASRAM_A3: U1.N3(IO,_DIFFIO_B1p) U8.B3(A3)
ASRAM_A4: U1.T3(IO,_DIFFIO_B2n) U8.B4(A4)
ASRAM_A5: U1.N5(IO,_DIFFIO_B4p,_(DQ3B)/(DQ5B)) U8.C3(A5)
ASRAM_A6: U1.P6(IO,_VREFB3N0) U8.C4(A6)
ASRAM_A7: U1.R10(IO,_DIFFIO_B16p,_(DQ5B)/(DQ5B)) U8.D4(A7)
ASRAM_A8: U1.N11(IO,_RDN2) U8.H2(A8)
ASRAM_A9: U1.N12(IO,_DIFFIO_B24p) U8.H3(A9)
ASRAM_A10: U1.T14(IO,_DIFFIO_B23p,_(DQ5B)/(DQ5B)) U8.H4(A10)
ASRAM_A11: U1.R13(IO,_DIFFIO_B20p) U8.H5(A11)
ASRAM_A12: U1.P11(IO,_VREFB4N0) U8.G3(A12)
ASRAM_A13: U1.T15(IO,_DIFFIO_B23n,_(DQS0B/CQ1B,CDPCLK3)/(DQS0B/CQ1B,CDPCLK3)) U8.G4(A13)
ASRAM_A14: U1.L8(IO,_DIFFIO_B9n,_(DQ3B)/(DQ5B)) U8.F3(A14)
ASRAM_A15: U1.T13(IO,_DIFFIO_B20n,_(DQ5B)/(DQ5B)) U8.F4(A15)
ASRAM_A16: U1.P8(IO,_DIFFIO_B12n,_(DQ5B)/(DQ5B)) U8.E4(A16)
ASRAM_A17: U1.M8(IO,_DIFFIO_B10n,_(DM5B/BWS#5B)/(DM5B/BWS#5B)) U8.D3(A17)
ASRAM_BHE_N: U1.L7(IO,_(DQ3B)/(DQ5B)) U8.B2(~{BHE})
ASRAM_BLE_N: U1.M6(IO,_(DQ3B)/(DQ5B)) U8.A1(~{BLE})
ASRAM_CE_N: U1.R5(IO,_DIFFIO_B6p,_(DQ3B)/(DQ5B)) U8.B5(~{CE})
ASRAM_IO0: U1.T6(IO,_DIFFIO_B7n) U8.B6(IO0)
ASRAM_IO1: U1.T7(IO,_DIFFIO_B8n,_(DQS5B/CQ5B#,DPCLK3)/(DQS5B/CQ5B#,DPCLK3)) U8.C6(IO1)
ASRAM_IO2: U1.R6(IO,_DIFFIO_B7p,_(DQ3B)/(DQ5B)) U8.C5(IO2)
ASRAM_IO3: U1.R7(IO,_DIFFIO_B8p,_(DQ3B)/(DQ5B)) U8.D5(IO3)
ASRAM_IO4: U1.T10(IO,_DIFFIO_B16n,_(DQS4B/CQ5B,DPCLK4)/(DQS4B/CQ5B,DPCLK4)) U8.E5(IO4)
ASRAM_IO5: U1.T11(IO,_DIFFIO_B17n) U8.F5(IO5)
ASRAM_IO6: U1.R11(IO,_DIFFIO_B17p,_(DQ5B)/(DQ5B)) U8.F6(IO6)
ASRAM_IO7: U1.R12(IO,_DIFFIO_B18p,_(DQ5B)/(DQ5B)) U8.G6(IO7)
ASRAM_IO8: U8.B1(IO8) ; port ASRAM_IO8
ASRAM_IO9: U8.C1(IO9) ; port ASRAM_IO9
ASRAM_IO10: U1.N6(IO,_DIFFIO_B4n,_(DQ3B)/(DQ5B)) U8.C2(IO10)
ASRAM_IO11: U1.M7(IO,_DIFFIO_B5p,_(DQS3B/CQ3B#,DPCLK2)/(DQS3B/CQ3B#,DPCLK2)) U8.D2(IO11)
ASRAM_IO12: U1.N8(IO,_DIFFIO_B11p,_(DQ5B)/(DQ5B)) U8.E2(IO12)
ASRAM_IO13: U1.N9(IO,_DIFFIO_B14n,_(DQ5B)/(DQ5B)) U8.F2(IO13)
ASRAM_IO14: U1.P9(IO,_(DQS2B/CQ3B,DPCLK5)/(DQS2B/CQ3B,DPCLK5)) U8.F1(IO14)
ASRAM_IO15: U1.M10(IO,_RUP2) U8.G1(IO15)
ASRAM_OE_N: U1.P3(IO,_DIFFIO_B1n,_(DM3B/BWS#3B)/(DM5B/BWS#5B)) U8.A2(~{OE})
ASRAM_WE_N: U1.T12(IO,_DIFFIO_B18n,_(DQ5B)/(DQ5B)) U8.G5(~{WE})
B3_23_PLL1_N: U1.T4(IO,_PLL1_CLKOUTn) ; port B3_23_PLL1_N
B3_24_PLL1_P: U1.R4(IO,_PLL1_CLKOUTp) ; port B3_24_PLL1_P
B4_27_PLL4_N: U1.R14(IO,_PLL4_CLKOUTn) ; port B4_27_PLL4_N
B4_28_PLL4_P: U1.P14(IO,_PLL4_CLKOUTp) ; port B4_28_PLL4_P

### Notes on the sheet
- SRAM, 128kByte Asynchronous
- Max 60mA
- Fit:
  4CE22 Build: ISSI IS61WV25616BLL-10BLI-TR
  4CE10 Build: Cypress CY62126EV30LL-45BVXIT,
- (near U8) checked pins against pcb - ok 3/2/11
- 37 PINS
- All Rights Reserved | www.thin-layer-embedded | www.fpgamodule.com
- © Copyright 2013 - Thin Layer Embedded
- (in symbol EP4CE22F17C8, part C) BANK 3
- (in symbol EP4CE22F17C8, part D) BANK 4

### Library data of the parts
C47 = CAP: Capacitor; Manufacturer: Yageo; Manufacturer Part Number: CC0402ZRY5V8BB104; Description: CAP CERAMIC .1UF 25V Y5V 0402; Capacitance: 0.1µF; Voltage - Rated: 25V; Tolerance: -20%, +80%; Temperature Coefficient: Y5V (F); Supplier 1: Digi-Key; Supplier 2: Digi-Key; RoHS: RoHS Compliant; Category: Capacitors; Stock 2: 808472; Pricing 2: 10=0.023, 100=0.0135, 500=0.0072, 1000=0.00488 (USD); Mounting Type: Surface Mount, MLCC; Operating Temperature: -30°C ~ 85°C; Applications: General Purpose; Ratings: -; Package / Case: 0402 (1005 Metric); Size / Dimension: 0.039" L x 0.020" W (1.00mm x 0.50mm); Height: -; Thickness: 0.020" (0.50mm); Lead Spacing: -; Features: -; Packaging: Cut Tape (CT); Lead Style: -; ComponentLink1URL: http://media.digikey.com/pdf/Data%20Sheets/Yageo%20PDFs/MLCC%20ordering%20code.pdf; ComponentLink1Description: http://media.digikey.com/pdf/Data%20Sheets/Yageo%20PDFs/MLCC%20ordering%20code.pdf; Supplier 3: Digi-Key; Supplier Part Number 3: 587-1231-2-ND
U1 = EP4CE22F17C8: Cyclone IV Family FPGA, 2V Core, 153 I/O Pins, 4 PLLs, 256-Pin FBGA, Speed Grade 8, Commercial Grade; Manufacturer: Altera; Manufacturer Part Number: EP4CE22F17C7N; Description: IC CYCLONE IV E FPGA 22K 256FBGA; Number of Logic Elements/Cells: 22320; Number of LABs/CLBs: 1395; Total RAM Bits: 608256; Number of I /O: 153; Voltage - Supply: 1.15 V ~ 1.25 V; Published: 3-May-2010; DatasheetVersion: ver1.2, Mar-2010; PackageVersion: ver16.0, Dec-2009; PackageReference: FBGA256; Publisher: Altium Limited; PackageDescription: 256-Ball FineLine Ball Grid Array (FBGA256) - Option 1 - Wire Bond; Code_JEDEC: MS-034-AAF-1; Code_IPC: BGA100P16X16-256; ComponentLink1Description: Manufacturer Link; ComponentLink1URL: http://www.altera.com/; ComponentLink2Description: Handbook; ComponentLink2URL: http://www.altera.com/literature/hb/cyclone-iv/cyclone4-handbook.pdf; ComponentLink3Description: Pinout Specification; ComponentLink3URL: http://www.altera.com/literature/lit-dp.jsp?category=cyc%204&showspreadsheet=y; ComponentLink4Description: Packaging Specification; ComponentLink4URL: http://www.altera.com/literature/ds/dspkg.pdf; Supplier 1: Digi-Key; RoHS: RoHS Compliant; Category: Integrated Circuits (ICs); Stock 1: 6; Pricing 1: 1=55.5 (USD); Number of Gates: -; Mounting Type: Surface Mount; Operating Temperature: 0°C ~ 85°C; Package / Case: 256-BGA; Supplier Device Package: 256-FBGA (17x17)
U8 = CY7C1021DV331: Manufacturer: Cypress Semiconductor Corp; Manufacturer Part Number: CY7C1021DV33-10BVXI; Description: IC SRAM 1MBIT 10NS 48VFBGA; Format - Memory: RAM; Memory Type: SRAM - Asynchronous; Memory Size: 1M (64K x 16); Speed: 10ns; Interface: Parallel; Voltage - Supply: 3 V ~ 3.6 V; Supplier 1: Digi-Key; RoHS: RoHS Compliant; Category: Integrated Circuits (ICs); Stock 1: 1470; Pricing 1: 1=2.64, 25=2.28, 100=2.16, 250=1.8, 500=1.74, 750=1.68, 1000=1.62, 2500=1.56, 5000=1.53 (USD); Operating Temperature: -40°C ~ 85°C; Package / Case: 48-VFBGA; Supplier Device Package: 48-VFBGA (6x8); Packaging: Tray; ComponentLink1URL: http://www.cypress.com/?docID=25628; ComponentLink1Description: http://www.cypress.com/?docID=25628

## Sheet 5 - Power.SchDoc
size A3; PageSetup: Record=PageOptions|CenterHorizontal=True|CenterVertical=True|PrintScale=0.98|XCorrection=1.00|YCorrection=1.00|PrintKind=1|BorderSize=5000000|LeftOffset=0|BottomOffset=0|Orientation=2|PaperLength=1000|PaperWidth=1000|Scale=100|PaperSource=258|PrintQuality=600|MediaType=1|DitherType=10|PaperKind=A4|PrintScaleMode=1
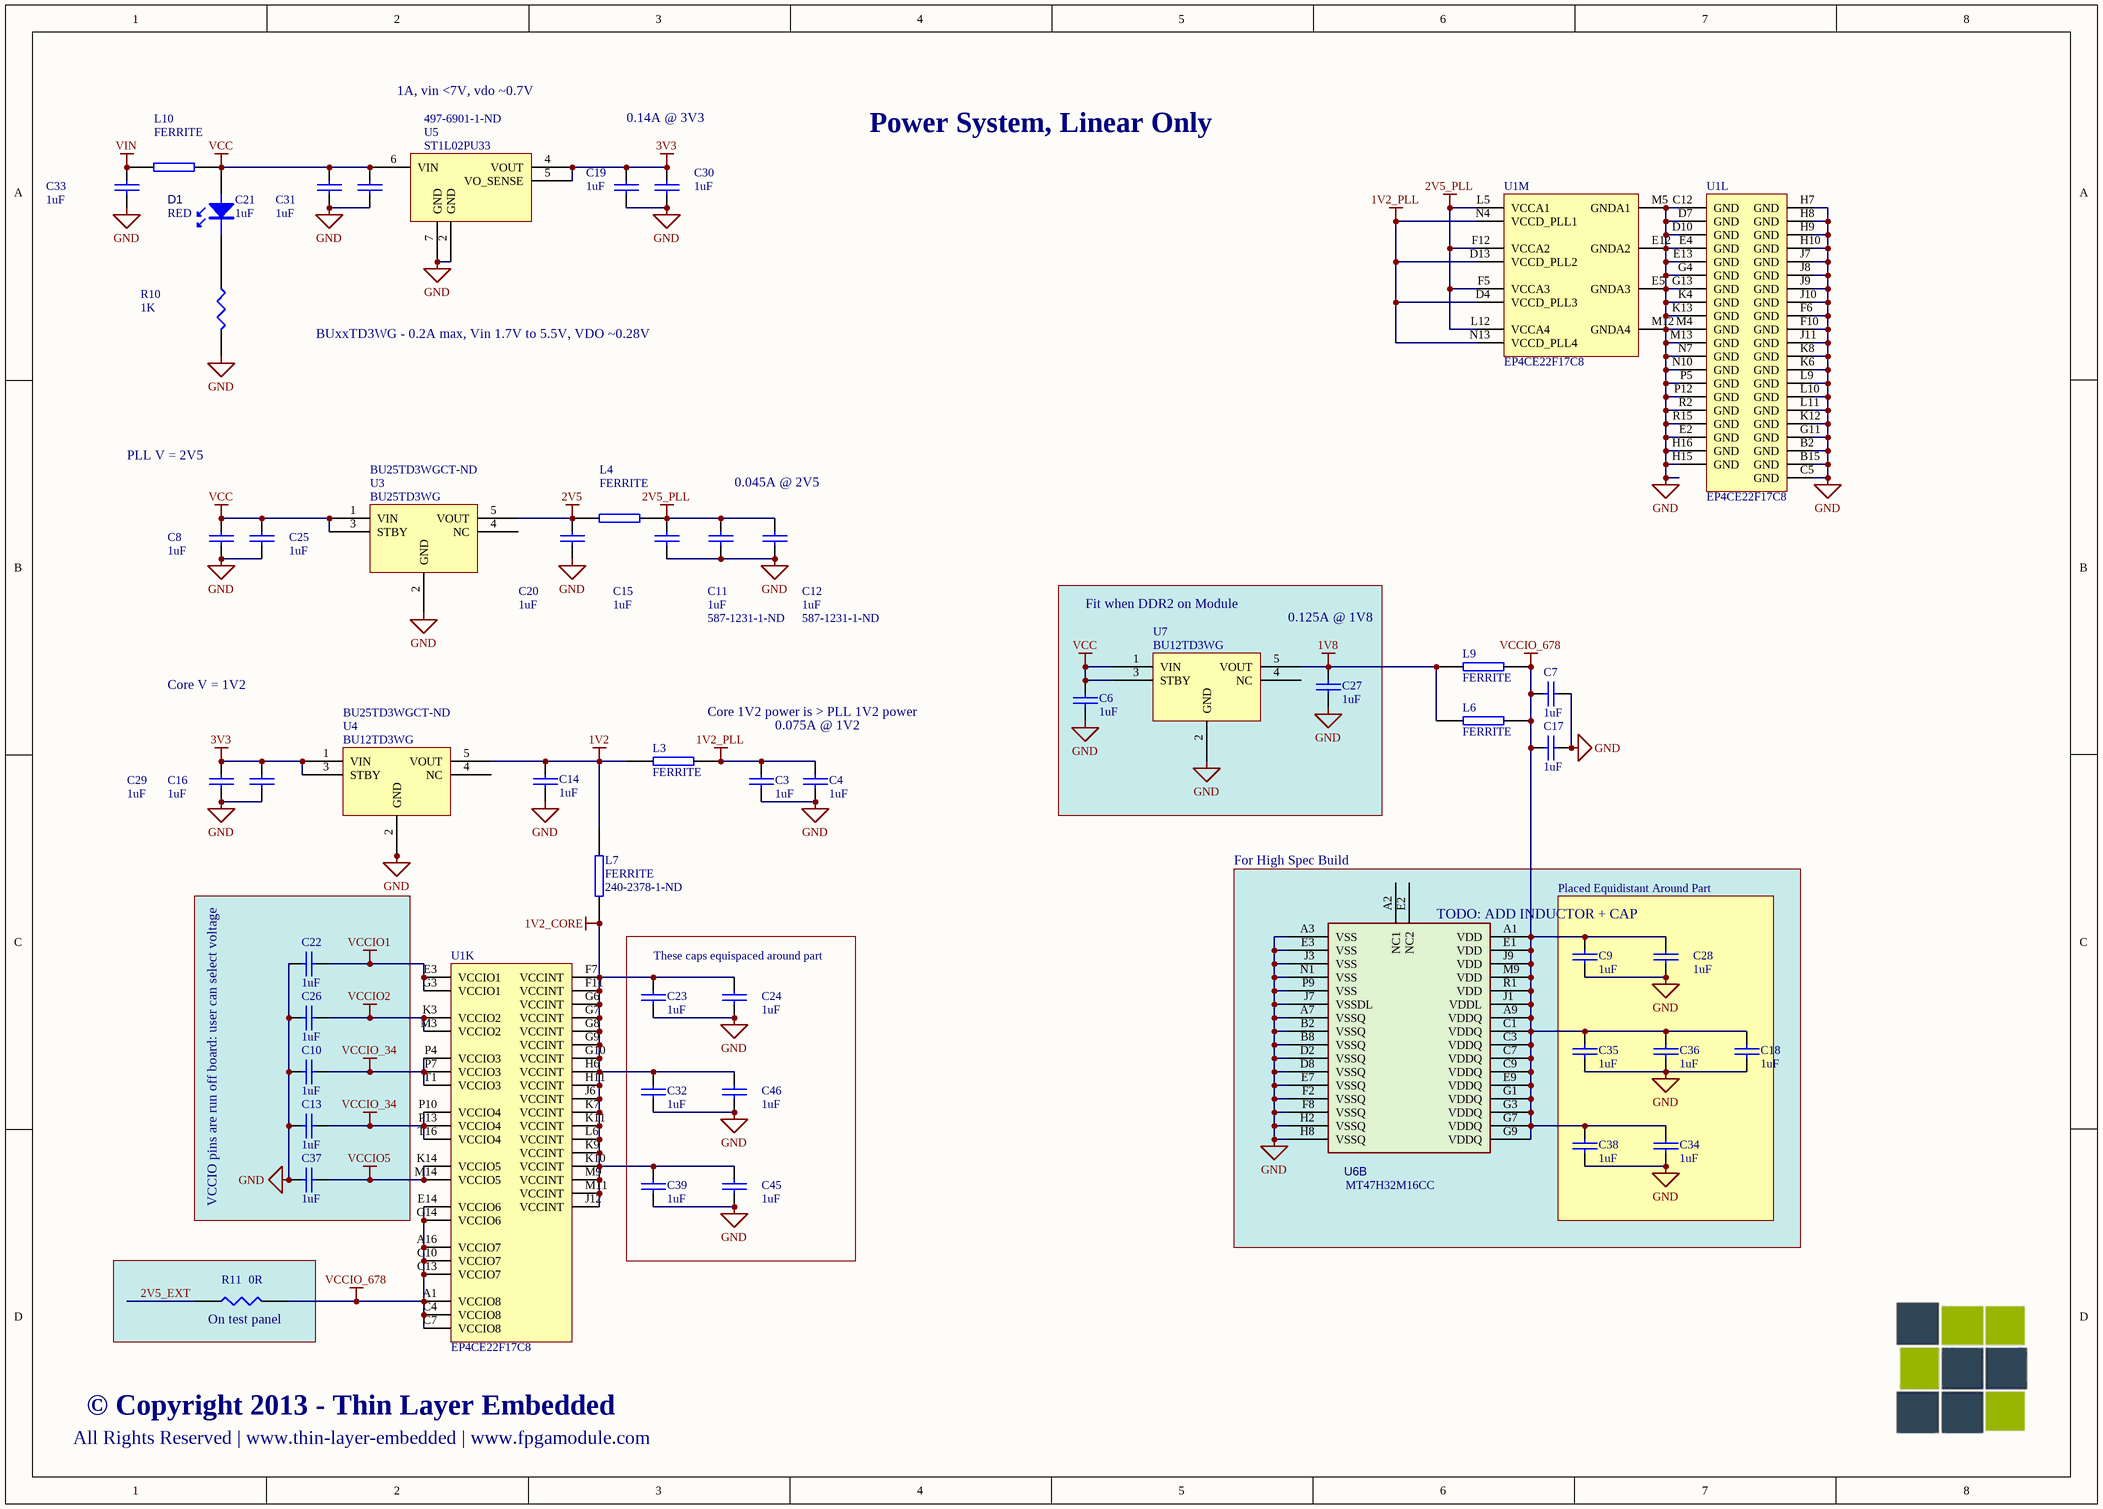
[diagram p5: 5 - Power.SchDoc]

### Parts
C3  1uF  [0402_HD]
C4  1uF  [0402_HD]
C6  1uF  [0402_HD]
C7  1uF  [0402_HD]
C8  1uF  [0402_HD]
C9  1uF  [0402_HD]
C10  1uF  [0402_HD]
C11  1uF  Supplier Part Number 2: 587-1231-1-ND  [0402_HD]
C12  1uF  Supplier Part Number 2: 587-1231-1-ND  [0402_HD]
C13  1uF  [0402_HD]
C14  1uF  [0402_HD]
C15  1uF  [0402_HD]
C16  1uF  [0402_HD]
C17  1uF  [0402_HD]
C18  1uF  [0402_HD]
C19  1uF  [0402_HD]
C20  1uF  [0402_HD]
C21  1uF  [0402_HD]
C22  1uF  [0402_HD]
C23  1uF  [0402_HD]
C24  1uF  [0402_HD]
C25  1uF  [0402_HD]
C26  1uF  [0402_HD]
C27  1uF  [0402_HD]
C28  1uF  [0402_HD]
C29  1uF  [0402_HD]
C30  1uF  [0402_HD]
C31  1uF  [0402_HD]
C32  1uF  [0402_HD]
C33  1uF  [0402_HD]
C34  1uF  [0402_HD]
C35  1uF  [0402_HD]
C36  1uF  [0402_HD]
C37  1uF  [0402_HD]
C38  1uF  [0402_HD]
C39  1uF  [0402_HD]
C45  1uF  [0402_HD]
C46  1uF  [0402_HD]
D1  RED  [0402LED_HD]
L3  FERRITE  [0402_HD]
L4  FERRITE  [0402_HD]
L6  FERRITE  [0402_HD]
L7  FERRITE  Supplier Part Number 1: 240-2378-1-ND  [0402_HD]
L9  FERRITE  [0402_HD]
L10  FERRITE  [0805]
R10  1K  [0402_HD]
R11  0R  [0402_HD]
U1  EP4CE22F17C8  [FBGA256]  (parts K,L,M of 13)
U3  BU25TD3WG  Supplier Part Number 1: BU25TD3WGCT-ND  [SSOP5]
U4  BU12TD3WG  Supplier Part Number 1: BU25TD3WGCT-ND  [SSOP5]
U5  ST1L02PU33  Supplier Part Number 1: 497-6901-1-ND  [DFN6]
U6  MT47H32M16CC  [DDR2_84_SPEC_HD]  (part B of 2)
U7  BU12TD3WG  [SSOP5]

### Blocks framed on the sheet
TODO: ADD INDUCTOR + CAP: U6
VCCIO pins are run off board: user can select voltage: C10 C13 C22 C26 C37
Placed Equidistant Around Part: C9 C18 C28 C34-C36 C38
These caps equispaced around part: C23 C24 C32 C39 C45 C46
On test panel: R11

### Nets
1V2: C14.1 L3.2 L7.1 U4.5(VOUT)
1V2_CORE: C23.1 C24.1 C32.1 C39.1 C45.1 C46.1 L7.2 U1.F7(VCCINT) U1.F11(VCCINT) U1.G6(VCCINT) U1.G7(VCCINT) U1.G8(VCCINT) U1.G9(VCCINT) U1.G10(VCCINT) U1.H6(VCCINT) U1.H11(VCCINT) U1.J6(VCCINT) U1.J12(VCCINT) U1.K7(VCCINT) U1.K9(VCCINT) U1.K10(VCCINT) U1.K11(VCCINT) U1.L6(VCCINT) U1.M9(VCCINT) U1.M11(VCCINT)
1V2_PLL: C3.1 C4.1 L3.1 U1.D4(VCCD_PLL3) U1.D13(VCCD_PLL2) U1.N4(VCCD_PLL1) U1.N13(VCCD_PLL4)
1V8: C27.1 L6.1 L9.1 U7.5(VOUT)
2V5: C20.2 L4.1 U3.5(VOUT)
2V5_PLL: C11.1 C12.1 C15.1 L4.2 U1.F5(VCCA3) U1.F12(VCCA2) U1.L5(VCCA1) U1.L12(VCCA4)
3V3: C16.1 C19.1 C29.1 C30.1 U4.1(VIN) U4.3(STBY) U5.4(VOUT) U5.5(VO_SENSE)
GND: C3.2 C4.2 C6.2 C7.2 C8.2 C9.2 C10.1 C11.2 C12.2 C13.1 C14.2 C15.2 C16.2 C17.2 C18.2 C19.2 C20.1 C21.2 C22.1 C23.2 C24.2 C25.2 C26.1 C27.2 C28.2 C29.2 C30.2 C31.2 C32.2 C33.1 C34.2 C35.2 C36.2 C37.1 C38.2 C39.2 C45.2 C46.2 R10.1 U1.B2(GND) U1.B15(GND) U1.C5(GND) U1.C12(GND) U1.D7(GND) U1.D10(GND) U1.E2(GND) U1.E4(GND) U1.E5(GNDA3) U1.E12(GNDA2) U1.E13(GND) U1.F6(GND) U1.F10(GND) U1.G4(GND) U1.G11(GND) U1.G13(GND) U1.H7(GND) U1.H8(GND) U1.H9(GND) U1.H10(GND) U1.H15(GND) U1.H16(GND) U1.J7(GND) U1.J8(GND) U1.J9(GND) U1.J10(GND) U1.J11(GND) U1.K4(GND) U1.K6(GND) U1.K8(GND) U1.K12(GND) U1.K13(GND) U1.L9(GND) U1.L10(GND) U1.L11(GND) U1.M4(GND) U1.M5(GNDA1) U1.M12(GNDA4) U1.M13(GND) U1.N7(GND) U1.N10(GND) U1.P5(GND) U1.P12(GND) U1.R2(GND) U1.R15(GND) U3.2(GND) U4.2(GND) U5.2(GND) U5.7(GND) U6.A3(VSS) U6.A7(VSSQ) U6.B2(VSSQ) U6.B8(VSSQ) U6.D2(VSSQ) U6.D8(VSSQ) U6.E3(VSS) U6.E7(VSSQ) U6.F2(VSSQ) U6.F8(VSSQ) U6.H2(VSSQ) U6.H8(VSSQ) U6.J3(VSS) U6.J7(VSSDL) U6.N1(VSS) U6.P9(VSS) U7.2(GND)
VCC: C6.1 C8.1 C21.1 C25.1 C31.1 D1.A L10.2 U3.1(VIN) U3.3(STBY) U5.6(VIN) U7.1(VIN) U7.3(STBY)
VCCIO1: C22.2 U1.E3(VCCIO1) U1.G3(VCCIO1)
VCCIO2: C26.2 U1.K3(VCCIO2) U1.M3(VCCIO2)
VCCIO5: C37.2 U1.K14(VCCIO5) U1.M14(VCCIO5)
VCCIO_34: C10.2 C13.2 U1.P4(VCCIO3) U1.P7(VCCIO3) U1.P10(VCCIO4) U1.P13(VCCIO4) U1.T1(VCCIO3) U1.T16(VCCIO4)
VCCIO_678: C7.1 C9.1 C17.1 C18.1 C28.1 C34.1 C35.1 C36.1 C38.1 L6.2 L9.2 R11.1 U1.A1(VCCIO8) U1.A16(VCCIO7) U1.C4(VCCIO8) U1.C7(VCCIO8) U1.C10(VCCIO7) U1.C13(VCCIO7) U1.E14(VCCIO6) U1.G14(VCCIO6) U6.A1(VDD) U6.A9(VDDQ) U6.C1(VDDQ) U6.C3(VDDQ) U6.C7(VDDQ) U6.C9(VDDQ) U6.E1(VDD) U6.E9(VDDQ) U6.G1(VDDQ) U6.G3(VDDQ) U6.G7(VDDQ) U6.G9(VDDQ) U6.J1(VDDL) U6.J9(VDD) U6.M9(VDD) U6.R1(VDD)
VIN: C33.2 L10.1
2V5_EXT: R11.2
NetD1_K: D1.K R10.2

Not connected (* = marked no-connect by the designer): U3 4(NC); U4 4(NC); U6 A2(NC1) E2(NC2); U7 4(NC)

### Notes on the sheet
- 1A, vin <7V, vdo ~0.7V
- 0.14A @ 3V3
- Power System, Linear Only
- BUxxTD3WG - 0.2A max, Vin 1.7V to 5.5V, VDO ~0.28V
- PLL V = 2V5
- 0.045A @ 2V5
- Fit when DDR2 on Module
- 0.125A @ 1V8
- Core V = 1V2
- Core 1V2 power is > PLL 1V2 power
- 0.075A @ 1V2
- For High Spec Build
- All Rights Reserved | www.thin-layer-embedded | www.fpgamodule.com
- © Copyright 2013 - Thin Layer Embedded

### Library data of the parts
C3 C4 C6-C39 C45 C46 = CAP: Capacitor; Supplier 1: Digi-Key; Supplier Part Number 1: 587-1231-2-ND
  C11 C12: Supplier 2: Digi-Key
D1 = LED
L4 = FERRITE: Current Rating: 300mA; DC Resistance (DCR): 300 mOhm Max; Category: Filters; ComponentLink1URL: http://www.yuden.co.jp/us/product/pdf/mlci07_e.pdf; ComponentLink1Description: http://www.yuden.co.jp/us/product/pdf/mlci07_e.pdf
L7 = FERRITE: Manufacturer: Laird-Signal Integrity Products; Manufacturer Part Number: HZ0603B102R-10; Description: FERRITE 200MA 1000 OHM 0603 SMD; Impedance @ Frequency: 1K Ohm @ 100MHz; Current Rating: 200mA; DC Resistance (DCR): 600 mOhm Max; Filter Type: Differential Mode - Single; Number of Lines: 1; Supplier 1: Digi-Key; RoHS: RoHS Compliant; Category: Filters; Stock 1: 918950; Pricing 1: 10=0.063, 50=0.0542, 100=0.0501, 250=0.04176, 500=0.03758, 1000=0.0334 (USD); Package / Case: 0603 (1608 Metric); Mounting Type: Surface Mount; Packaging: Cut Tape (CT); ComponentLink1URL: http://www.steward.com/view_print.asp?St_PartNo=HZ0603B102R-10; ComponentLink1Description: http://www.steward.com/view_print.asp?St_PartNo=HZ0603B102R-10; Supplier Part Number 1: 587-1231-2-ND
R10 = RES1: Supplier 1: Digi-Key; Supplier Part Number 1: P1.0KJCT-ND; Supplier Part Number 1: 587-1231-2-ND
R11 = RES1: as R1 on sheet 2 - FPGA; Supplier 1: Digi-Key; RoHS: RoHS Compliant; Category: Resistors; Stock 1: 237555; Pricing 1: 10=0.014, 50=0.0104, 100=0.0079, 250=0.00584, 500=0.00432, 1000=0.00288 (USD); Composition: Thick Film; Features: -; Size / Dimension: 0.039" L x 0.020" W (1.00mm x 0.50mm); Height: 0.014" (0.35mm); Number of Terminations: 2; Packaging: Cut Tape (CT); Package / Case: 0402 (1005 Metric); ComponentLink1URL: http://www.yageo.com/documents/recent/PYu-RC0402_51_RoHS_L_6.pdf; ComponentLink1Description: http://www.yageo.com/documents/recent/PYu-RC0402_51_RoHS_L_6.pdf; Supplier 2: Digi-Key; Stock 2: 302870; Pricing 2: 10=0.014, 50=0.0104, 100=0.0079, 250=0.00584, 500=0.00432, 1000=0.00288 (USD); ComponentLink2URL: http://www.yageo.com/documents/recent/PYu-RC0603_51_RoHS_L_4.pdf; ComponentLink2Description: http://www.yageo.com/documents/recent/PYu-RC0603_51_RoHS_L_4.pdf
U1 = EP4CE22F17C8: as U1 on sheet 2 - FPGA; Published: 3-May-2010; DatasheetVersion: ver1.2, Mar-2010; PackageVersion: ver16.0, Dec-2009; PackageReference: FBGA256; Publisher: Altium Limited; PackageDescription: 256-Ball FineLine Ball Grid Array (FBGA256) - Option 1 - Wire Bond; Code_JEDEC: MS-034-AAF-1; Code_IPC: BGA100P16X16-256; ComponentLink1Description: Manufacturer Link; ComponentLink1URL: http://www.altera.com/; ComponentLink2Description: Handbook; ComponentLink2URL: http://www.altera.com/literature/hb/cyclone-iv/cyclone4-handbook.pdf; ComponentLink3Description: Pinout Specification; ComponentLink3URL: http://www.altera.com/literature/lit-dp.jsp?category=cyc%204&showspreadsheet=y; ComponentLink4Description: Packaging Specification; ComponentLink4URL: http://www.altera.com/literature/ds/dspkg.pdf
U3 U4 = BU12TD3WG: Manufacturer: Rohm Semiconductor; Manufacturer Part Number: BU25TD3WG-TR; Description: IC REG LDO 2.5V 0.2A 5SSOP; Regulator Topology: Positive Fixed; Voltage - Output: 2.5V; Voltage - Input: Up to 5.5V; Voltage - Dropout (Typical): 0.28V @ 200mA; Number of Regulators: 1; Current - Output: 200mA (Max); Current - Limit (Min): 220mA; Supplier 1: Digi-Key; RoHS: RoHS Compliant; Category: Integrated Circuits (ICs); Stock 1: 6000; Pricing 1: 1=0.5, 25=0.3484, 100=0.2987, 250=0.25792, 500=0.22172, 1000=0.17195 (USD); Operating Temperature: -40°C ~ 85°C; Mounting Type: Surface Mount; Package / Case: 6-LSOP (0.063", 1.60mm Width) 5 Leads; Supplier Device Package: 5-SSOP; Packaging: Cut Tape (CT); ComponentLink1URL: http://www.rohm.com/products/databook/power/pdf/buxxtd3wg-e.pdf; ComponentLink1Description: http://www.rohm.com/products/databook/power/pdf/buxxtd3wg-e.pdf; Supplier Part Number 1: 587-1231-2-ND
U5 = ST1L02PU33: Manufacturer: STMicroelectronics; Manufacturer Part Number: ST1L02PU33R; Description: IC VREG LDO 1A 3.3V DFN-6D; Regulator Topology: Positive Fixed; Voltage - Output: 3.3V; Voltage - Input: 4.5 V ~ 7 V; Voltage - Dropout (Typical): 0.7V @ 1A; Number of Regulators: 1; Current - Output: 1A; Supplier 1: Digi-Key; RoHS: RoHS Compliant; Category: Integrated Circuits (ICs); Stock 1: 2795; Pricing 1: 1=1.8, 10=1.608, 100=1.2771, 250=1.11156, 500=0.9933, 1000=0.78045 (USD); Current - Limit (Min): 1A; Operating Temperature: 0°C ~ 125°C; Mounting Type: Surface Mount; Package / Case: 6-VDFN Exposed Pad; Supplier Device Package: 6-DFN (3x3); Packaging: Cut Tape (CT); ComponentLink1URL: http://www.st.com/internet/com/TECHNICAL_RESOURCES/TECHNICAL_LITERATURE/DATASHEET/CD00050492.pdf; ComponentLink1Description: http://www.st.com/internet/com/TECHNICAL_RESOURCES/TECHNICAL_LITERATURE/DATASHEET/CD00050492.pdf; Supplier Part Number 1: 587-1231-2-ND
U6 = MT47H32M16CC: IC DDR2 SDRAM 32M X 16 4 BANKS 333MHZ CAS LATENCY 5 FBGA PACKAGE 84 PINS 1.8V CORE 1.8V IO; Manufacturer Part Num: MT47H32M16CC-3:B; Manufacturer: Micron; Item Num: P01-13045R; Manufacturer's Part No.: MT47H32M16CC-3:B

## Nets that join several sheets
2V5: 2 - FPGA (R2.2 RN1.2 RN1.3), 5 - Power (C20.2 L4.1 U3.5)
3V3: 2 - FPGA (L1.2), 4 - DDR2 DRAM (L5.2 R4.1 R5.1), 5 - Power (8 pins)
GND: 2 - FPGA (15 pins), 4 - DDR2 DRAM (8 pins), 3 - SRAM (C47.2 U8.D1 U8.E6), 5 - Power (105 pins)
VCCIO1: 2 - FPGA (5 pins), 5 - Power (C22.2 U1.E3 U1.G3)
VCCIO2: 2 - FPGA (L2.2 U1.L3), 5 - Power (C26.2 U1.K3 U1.M3)
VCCIO_34: 3 - SRAM (L8.2), 5 - Power (8 pins)
VCCIO_678: 2 - FPGA (6 pins), 4 - DDR2 DRAM (C52.1 R15.1), 5 - Power (36 pins)
ASRAM_IO8: 2 - FPGA (U1.K5), 3 - SRAM (U8.B1)
ASRAM_IO9: 2 - FPGA (U1.R1), 3 - SRAM (U8.C1)